# Altium project M8 Minima.PrjPcb (part 3 of 3)

## Sheet 08 usb hub.SchDoc
size A3; SheetNumber: 12; SheetTotal: 16
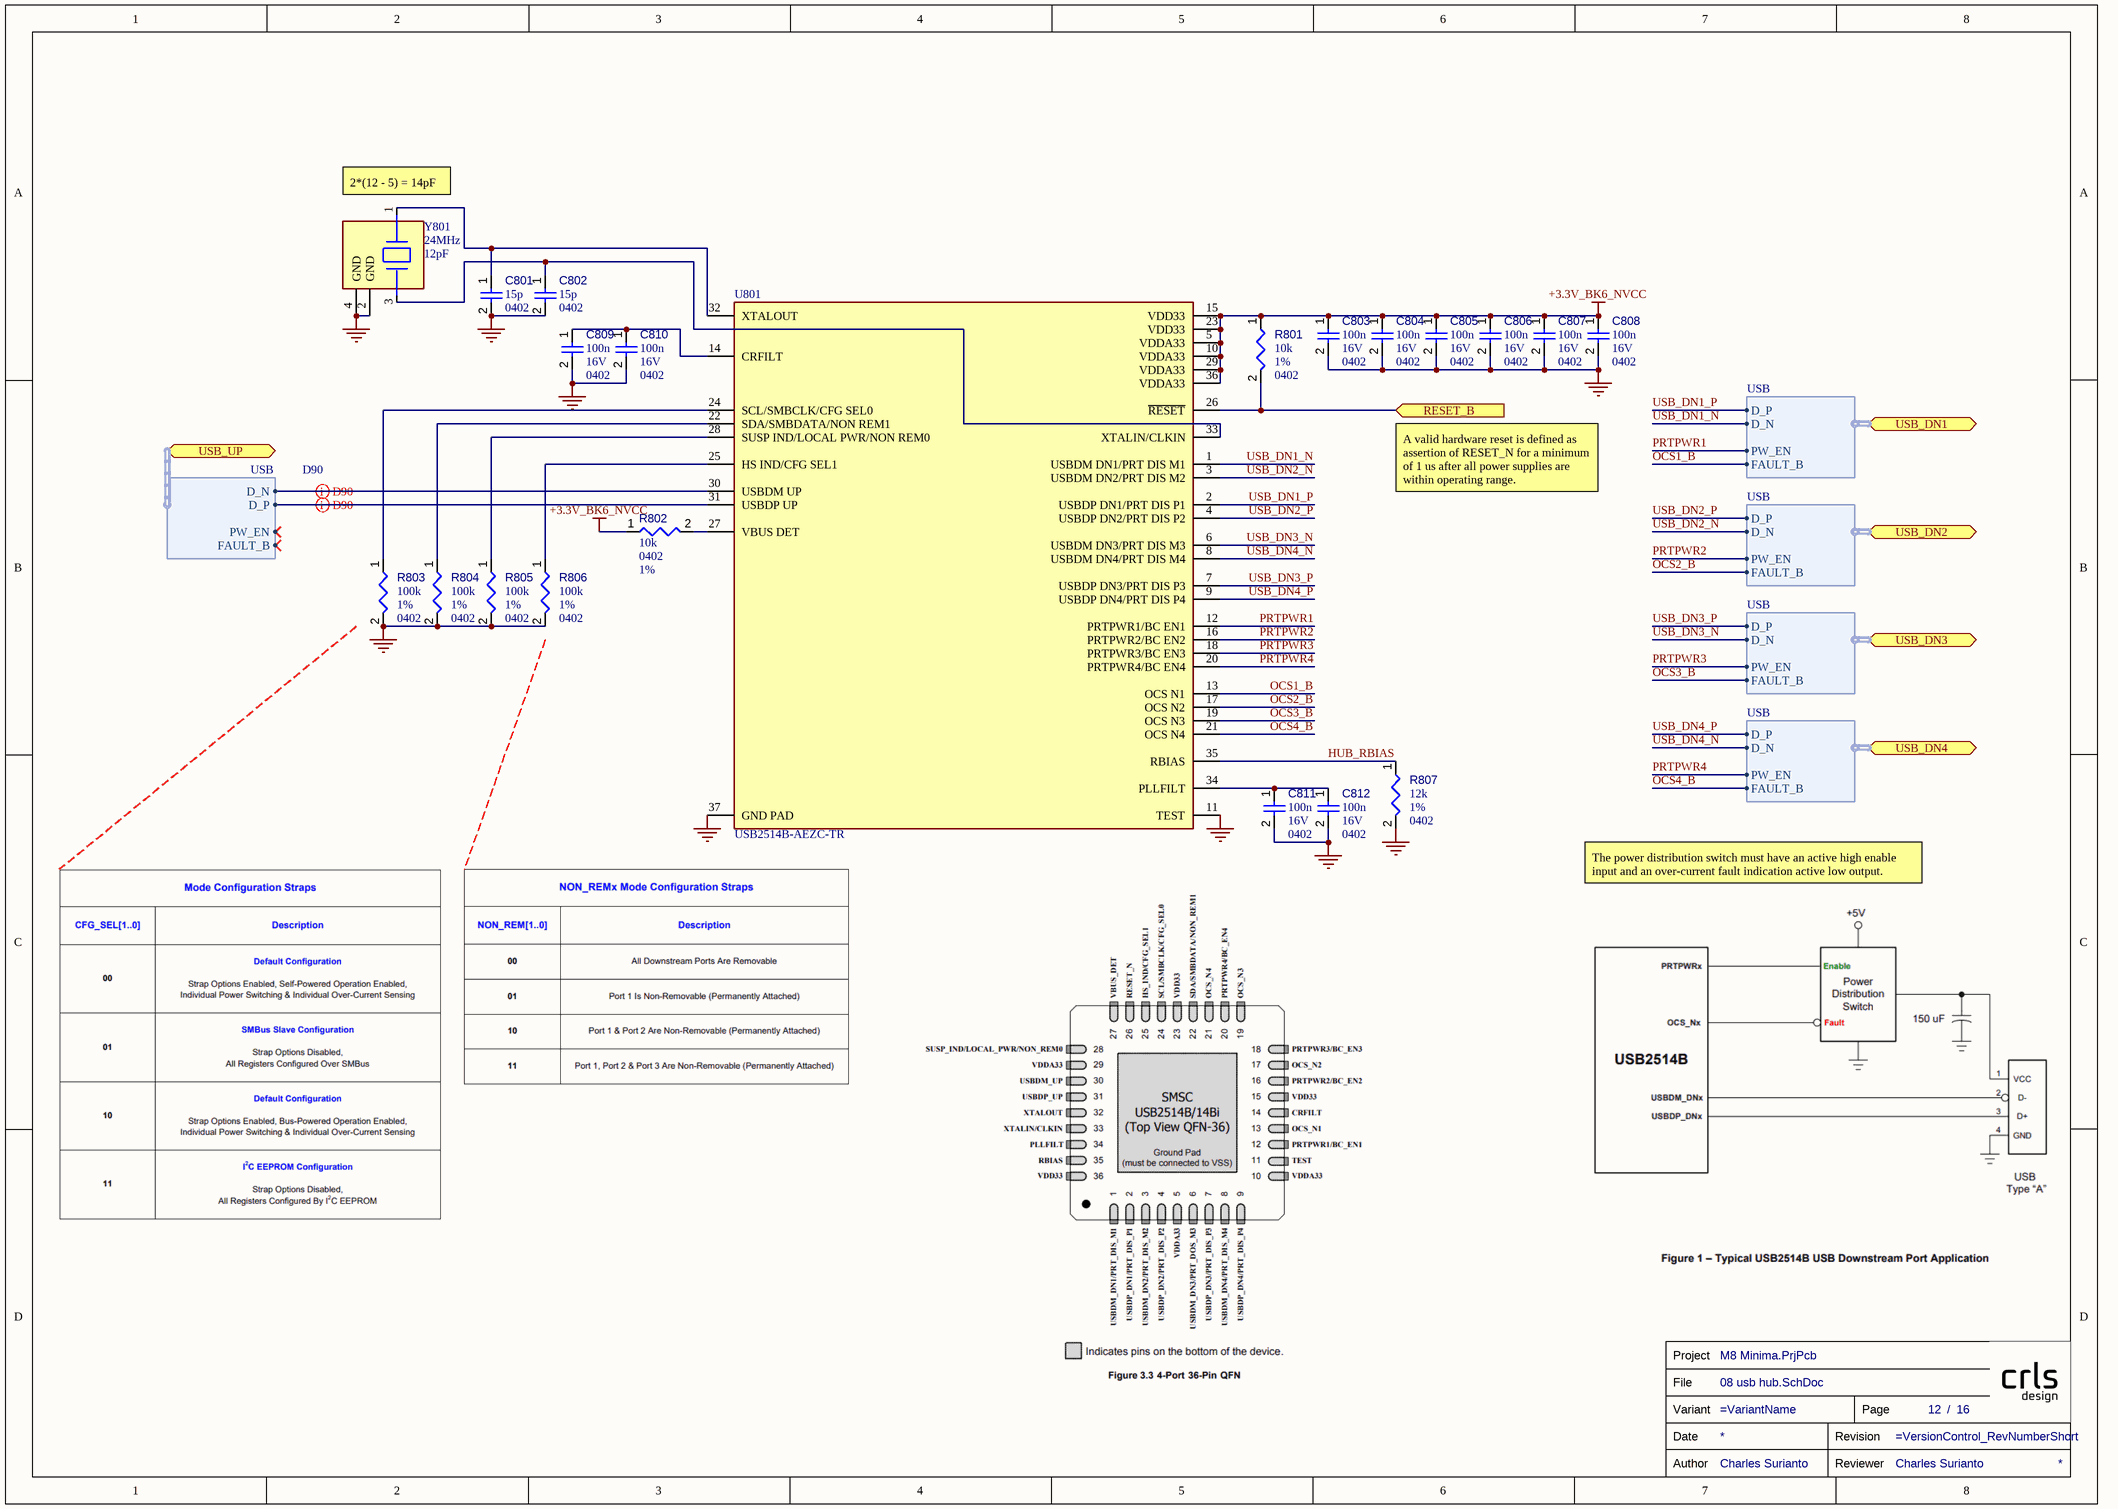
[diagram p9: 08 usb hub.SchDoc]

### Parts
(Parts that share a designator on the sheet are numbered #1, #2 ... from top to bottom, then left to right.)
C801  value 15p  Case/Package: 0402  [CAPC0402(1005)60_L]  (hidden comment: Capacitors,0402,15p)
C802  value 15p  Case/Package: 0402  [CAPC0402(1005)60_L]  (hidden comment: Capacitors,0402,15p)
C803  value 100n  Case/Package: 0402  Voltage Rating: 16V  [CAPC0402(1005)60_L]  (hidden comment: Capacitors,0402,100n,16V)
C804  value 100n  Case/Package: 0402  Voltage Rating: 16V  [CAPC0402(1005)60_L]  (hidden comment: Capacitors,0402,100n,16V)
C805  value 100n  Case/Package: 0402  Voltage Rating: 16V  [CAPC0402(1005)60_L]  (hidden comment: Capacitors,0402,100n,16V)
C806  value 100n  Case/Package: 0402  Voltage Rating: 16V  [CAPC0402(1005)60_L]  (hidden comment: Capacitors,0402,100n,16V)
C807  value 100n  Case/Package: 0402  Voltage Rating: 16V  [CAPC0402(1005)60_L]  (hidden comment: Capacitors,0402,100n,16V)
C808  value 100n  Case/Package: 0402  Voltage Rating: 16V  [CAPC0402(1005)60_L]  (hidden comment: Capacitors,0402,100n,16V)
C809  value 100n  Case/Package: 0402  Voltage Rating: 16V  [CAPC0402(1005)60_L]  (hidden comment: Capacitors,0402,100n,16V)
C810  value 100n  Case/Package: 0402  Voltage Rating: 16V  [CAPC0402(1005)60_L]  (hidden comment: Capacitors,0402,100n,16V)
C811  value 100n  Case/Package: 0402  Voltage Rating: 16V  [CAPC0402(1005)60_L]  (hidden comment: Capacitors,0402,100n,16V)
C812  value 100n  Case/Package: 0402  Voltage Rating: 16V  [CAPC0402(1005)60_L]  (hidden comment: Capacitors,0402,100n,16V)
R801  value 10k  Case/Package: 0402  Tolerance: 1%  [RESC0402(1005)_L]  (hidden comment: Resistors,0402,1%,10k)
R802  value 10k  Case/Package: 0402  Tolerance: 1%  [RESC0402(1005)_L]  (hidden comment: Resistors,0402,1%,10k)
R803  value 100k  Case/Package: 0402  Tolerance: 1%  [RESC0402(1005)_L]  (hidden comment: Resistors,0402,1%,100k)
R804  value 100k  Case/Package: 0402  Tolerance: 1%  [RESC0402(1005)_L]  (hidden comment: Resistors,0402,1%,100k)
R805  value 100k  Case/Package: 0402  Tolerance: 1%  [RESC0402(1005)_L]  (hidden comment: Resistors,0402,1%,100k)
R806  value 100k  Case/Package: 0402  Tolerance: 1%  [RESC0402(1005)_L]  (hidden comment: Resistors,0402,1%,100k)
R807  value 12k  Case/Package: 0402  Tolerance: 1%  [RESC0402(1005)_L]  (hidden comment: Resistors,0402,1%,12k)
TB?#9  Reviewer: Charles Surianto  (hidden comment: TITLE_BLOCK)  (graphical)
U801  USB2514B-AEZC-TR  [FP-USB2514B-AEZC-TR-MFG]
Y801  Load Capacitance: 12pF  Frequency: 24MHz  [FP-TSX-3225-MFG]  (hidden comment: TSX-3225 24.0000MF20G-AC3)

### Ports
RESET_B (in), USB_DN1 (bidir, harness USB), USB_DN2 (bidir, harness USB), USB_DN3 (bidir, harness USB), USB_DN4 (bidir, harness USB), USB_UP (bidir, harness USB)

### Harnesses
USB: D_P, D_N, PW_EN, FAULT_B

### Nets
+3.3V_BK6_NVCC: C803.1 C804.1 C805.1 C806.1 C807.1 C808.1 R801.1 R802.1 U801.5(VDDA33) U801.10(VDDA33) U801.15(VDD33) U801.23(VDD33) U801.29(VDDA33) U801.36(VDDA33)
GND: C801.2 C802.2 C803.2 C804.2 C805.2 C806.2 C807.2 C808.2 C809.2 C810.2 C811.2 C812.2 R803.2 R804.2 R805.2 R806.2 R807.2 U801.11(TEST) U801.37(GND_PAD) Y801.2(GND) Y801.4(GND)
HUB_RBIAS: R807.1 U801.35(RBIAS)
HUB_RST_B: R801.2 U801.26(~{RESET}) ; port RESET_B
OCS1_B: U801.13(OCS_N1) ; port USB_DN1.FAULT_B  [project net HUB_USB1.FAULT_B]
OCS2_B: U801.17(OCS_N2) ; port USB_DN2.FAULT_B  [project net HUB_USB2.FAULT_B]
OCS3_B: U801.19(OCS_N3) ; port USB_DN3.FAULT_B  [project net HUB_USB3.FAULT_B]
OCS4_B: U801.21(OCS_N4) ; port USB_DN4.FAULT_B  [project net HUB_USB4.FAULT_B]
PRTPWR1: U801.12(PRTPWR1/BC_EN1) ; port USB_DN1.PW_EN  [project net HUB_USB1.PW_EN]
PRTPWR2: U801.16(PRTPWR2/BC_EN2) ; port USB_DN2.PW_EN  [project net HUB_USB2.PW_EN]
PRTPWR3: U801.18(PRTPWR3/BC_EN3) ; port USB_DN3.PW_EN  [project net HUB_USB3.PW_EN]
PRTPWR4: U801.20(PRTPWR4/BC_EN4) ; port USB_DN4.PW_EN  [project net HUB_USB4.PW_EN]
USB2.D_N: U801.30(USBDM_UP) ; port USB_UP.D_N
USB2.D_P: U801.31(USBDP_UP) ; port USB_UP.D_P
USB_DN1_N: U801.1(USBDM_DN1/PRT_DIS_M1) ; port USB_DN1.D_N  [project net HUB_USB1.D_N]
USB_DN1_P: U801.2(USBDP_DN1/PRT_DIS_P1) ; port USB_DN1.D_P  [project net HUB_USB1.D_P]
USB_DN2_N: U801.3(USBDM_DN2/PRT_DIS_M2) ; port USB_DN2.D_N  [project net HUB_USB2.D_N]
USB_DN2_P: U801.4(USBDP_DN2/PRT_DIS_P2) ; port USB_DN2.D_P  [project net HUB_USB2.D_P]
USB_DN3_N: U801.6(USBDM_DN3/PRT_DIS_M3) ; port USB_DN3.D_N  [project net HUB_USB3.D_N]
USB_DN3_P: U801.7(USBDP_DN3/PRT_DIS_P3) ; port USB_DN3.D_P  [project net HUB_USB3.D_P]
USB_DN4_N: U801.8(USBDM_DN4/PRT_DIS_M4) ; port USB_DN4.D_N  [project net HUB_USB4.D_N]
USB_DN4_P: U801.9(USBDP_DN4/PRT_DIS_P4) ; port USB_DN4.D_P  [project net HUB_USB4.D_P]
NetC801_1: C801.1 U801.32(XTALOUT) Y801.1
NetC802_1: C802.1 U801.33(XTALIN/CLKIN) Y801.3
NetC809_1: C809.1 C810.1 U801.14(CRFILT)
NetC811_1: C811.1 C812.1 U801.34(PLLFILT)
NetR802_2: R802.2 U801.27(VBUS_DET)
NetR803_1: R803.1 U801.24(SCL/SMBCLK/CFG_SEL0)
NetR804_1: R804.1 U801.22(SDA/SMBDATA/NON_REM1)
NetR805_1: R805.1 U801.28(SUSP_IND/LOCAL_PWR/NON_REM0)
NetR806_1: R806.1 U801.25(HS_IND/CFG_SEL1)

### Layout directives
differential pair; differential pair class D90: USB2.D_N, USB2.D_P

### Notes on the sheet
- (near Y801) 2*(12 - 5) = 14pF
- A valid hardware reset is defined as assertion of RESET_N for a minimum of 1 us after all power supplies are within operating range.
- The power distribution switch must have an active high enable input and an over-current fault indication active low output.
- (in symbol TITLE_BLOCK) Project; File; Variant; Page; /; Date; Revision; Author; Reviewer

### Library data of the parts
C801-C812 = Capacitors: Capacitor; Component Type: Capacitors
R801-R807 = Resistors: Resistor; Component Type: Resistors
U801 = CMP-06284-000026-1: IC CONTROLLER USB 36QFN; Operating Supply Voltage: 3.3V; Operating Supply Current: 70mA; Number of Ports: 4; Lead Free: Lead Free; RoHS Compliant: Yes; Series: -; Case/Package: QFN; Interface: USB; Max Operating Temperature: 85°C; Packaging: Tape and Reel; Min Operating Temperature: 0°C; Package Quantity: 3000; Radiation Hardening: No
Y801 = CMP-36405-000018-1: CRYSTAL 24.0000MHZ 9PF SMD; ESR (Equivalent Series Resistance): 40R; Frequency Stability: 20ppm; Tolerance: 10ppm; Drive Level: 200uW; Min Operating Temperature: -40°C; RoHS Compliant: Yes; Width: 2.5mm; Max Operating Temperature: 105°C; Package Quantity: 250; Mount: Surface Mount; Lead Free: Lead Free; Height: 0.024inch; Depth: 2.5mm; Packaging: Tape and Reel; Series: TSX-3225; Weight: 0.000564oz; Number of Pins: 4; Termination: SMD/SMT; Case/Package: SMD/SMT; Length: 3.2mm; Frequency Tolerance: 10ppm
TB?#9 = TITLE_BLOCK: Review Date: *

## Sheet 11 pcie.SchDoc
size A3; SheetNumber: 15; SheetTotal: 16
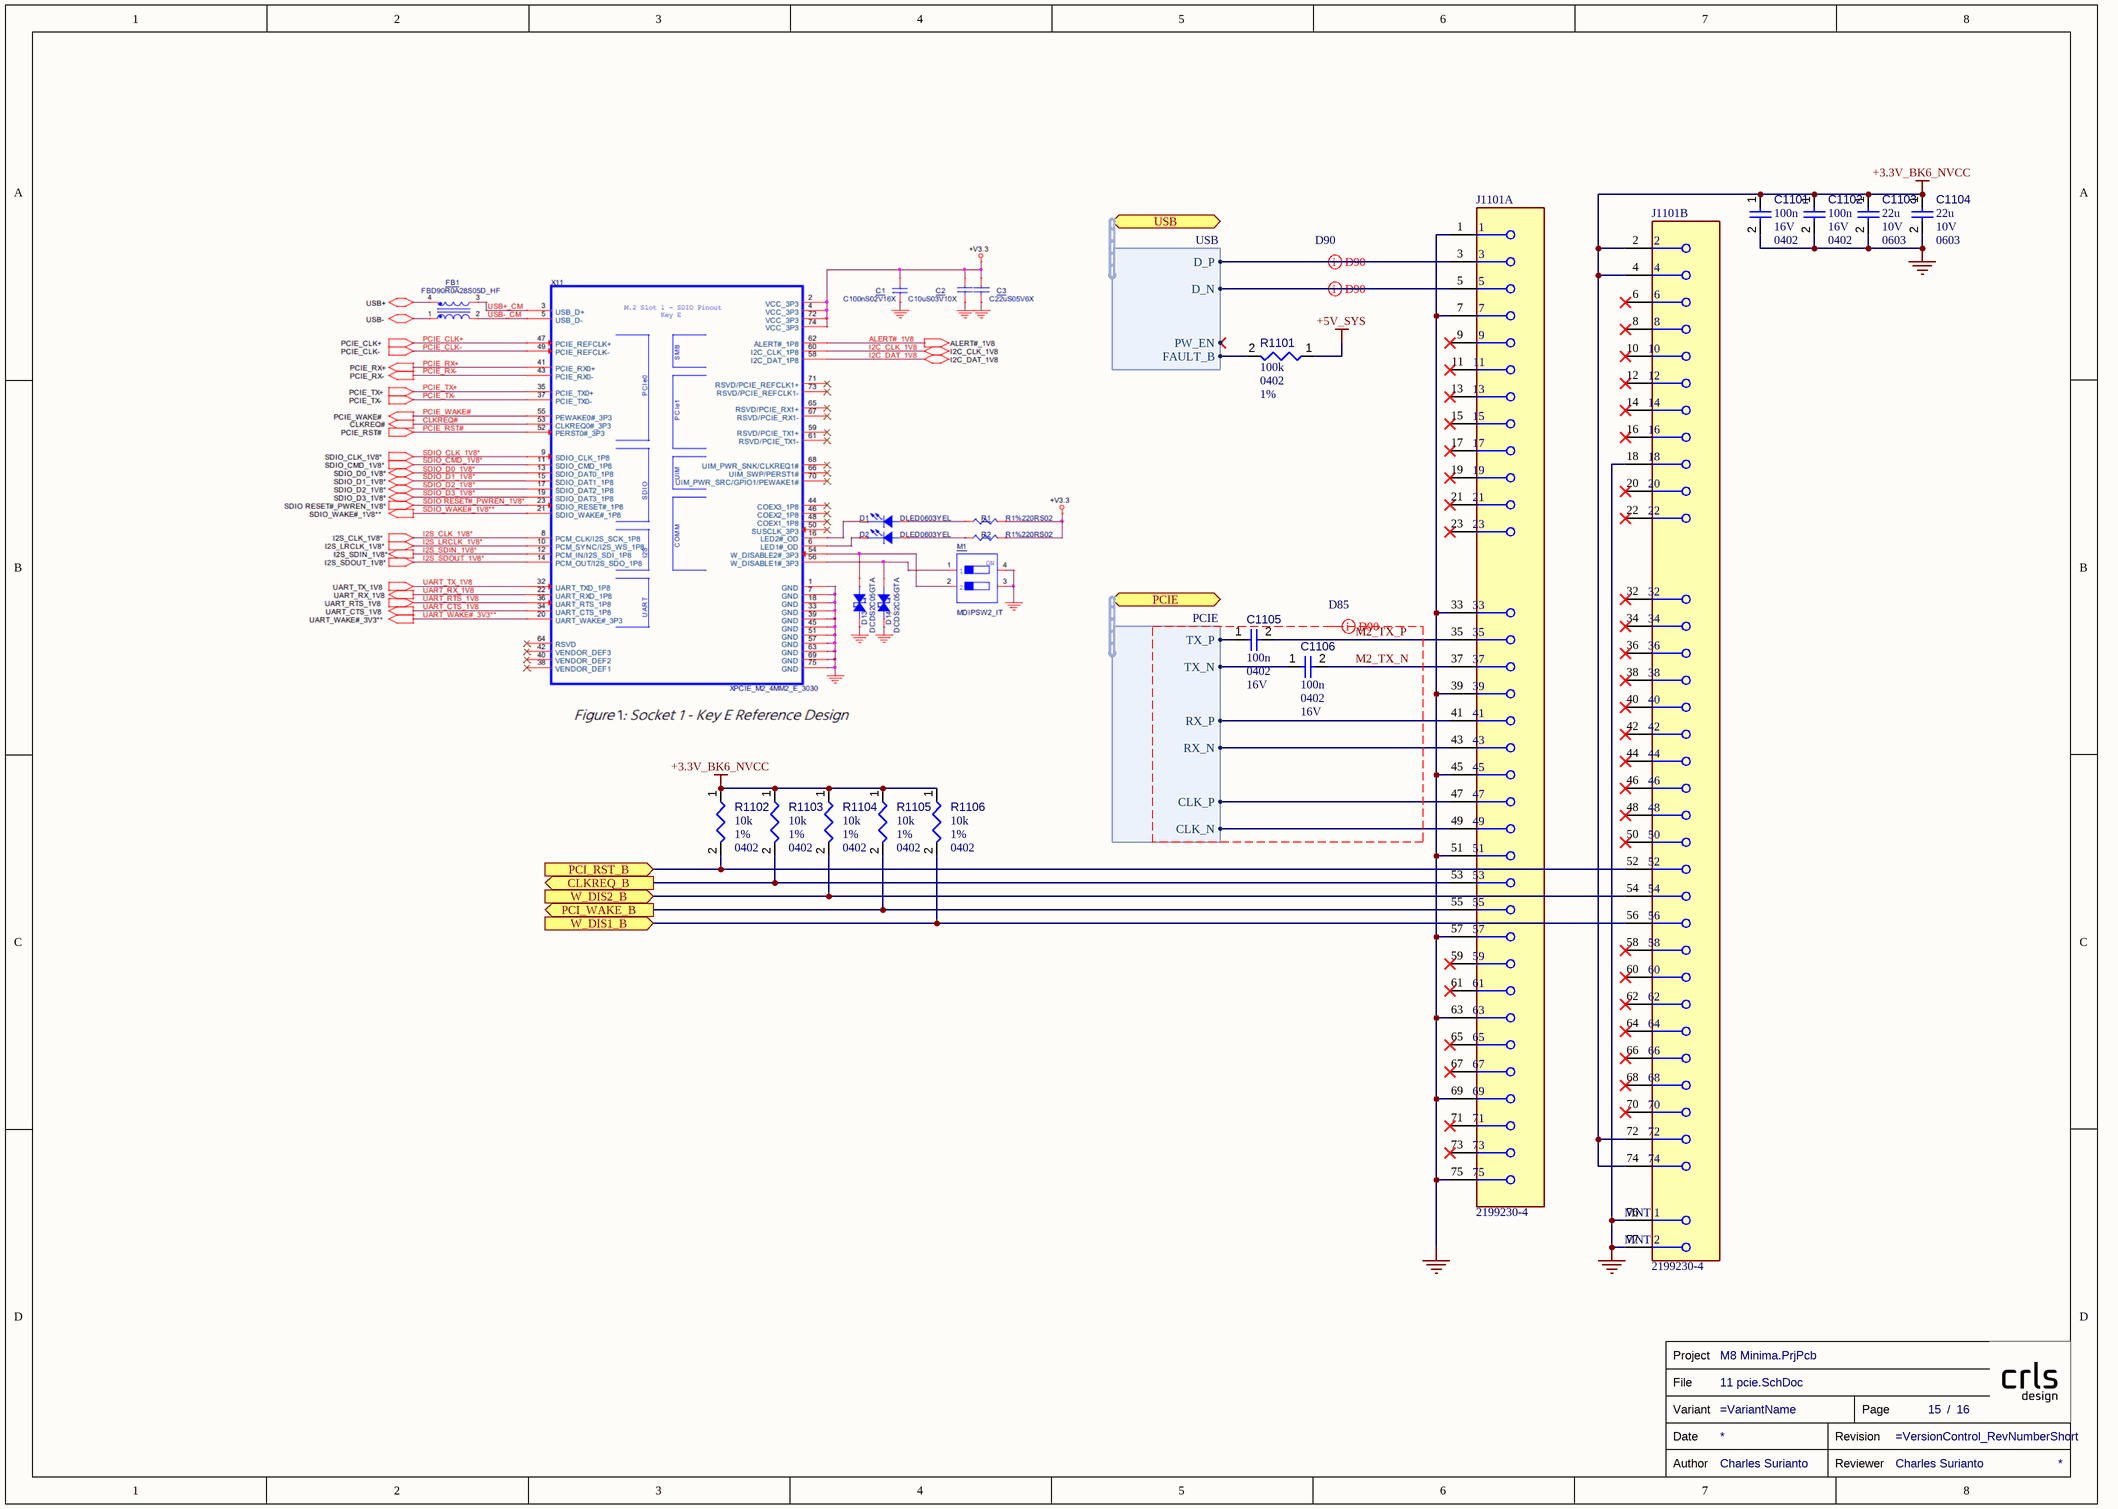
[diagram p10: 11 pcie.SchDoc]

### Parts
(Parts that share a designator on the sheet are numbered #1, #2 ... from top to bottom, then left to right.)
C1101  value 100n  Case/Package: 0402  Voltage Rating: 16V  [CAPC0402(1005)60_L]  (hidden comment: Capacitors,0402,100n,16V)
C1102  value 100n  Case/Package: 0402  Voltage Rating: 16V  [CAPC0402(1005)60_L]  (hidden comment: Capacitors,0402,100n,16V)
C1103  value 22u  Case/Package: 0603  Voltage Rating: 10V  [CAPC0603(1608)100_L]  (hidden comment: Capacitors,0603,22u,10V)
C1104  value 22u  Case/Package: 0603  Voltage Rating: 10V  [CAPC0603(1608)100_L]  (hidden comment: Capacitors,0603,22u,10V)
C1105  value 100n  Case/Package: 0402  Voltage Rating: 16V  [CAPC0402(1005)60_L]  (hidden comment: Capacitors,0402,100n,16V)
C1106  value 100n  Case/Package: 0402  Voltage Rating: 16V  [CAPC0402(1005)60_L]  (hidden comment: Capacitors,0402,100n,16V)
J1101  2199230-4  [FP-2199230-4-MFG]  (parts A,B of 2)
R1101  value 100k  Case/Package: 0402  Tolerance: 1%  [RESC0402(1005)_L]  (hidden comment: Resistors,0402,1%,100k)
R1102  value 10k  Case/Package: 0402  Tolerance: 1%  [RESC0402(1005)_L]  (hidden comment: Resistors,0402,1%,10k)
R1103  value 10k  Case/Package: 0402  Tolerance: 1%  [RESC0402(1005)_L]  (hidden comment: Resistors,0402,1%,10k)
R1104  value 10k  Case/Package: 0402  Tolerance: 1%  [RESC0402(1005)_L]  (hidden comment: Resistors,0402,1%,10k)
R1105  value 10k  Case/Package: 0402  Tolerance: 1%  [RESC0402(1005)_L]  (hidden comment: Resistors,0402,1%,10k)
R1106  value 10k  Case/Package: 0402  Tolerance: 1%  [RESC0402(1005)_L]  (hidden comment: Resistors,0402,1%,10k)
TB?#10  Reviewer: Charles Surianto  (hidden comment: TITLE_BLOCK)  (graphical)

### Ports
CLKREQ_B (out), PCI_RST_B (in), PCI_WAKE_B (out), PCIE (bidir, harness PCIE), USB (bidir, harness USB), W_DIS1_B (in), W_DIS2_B (in)

### Harnesses
PCIE: TX_N, RX_P, RX_N, CLK_N, CLK_P, TX_P
USB: D_P, D_N, FAULT_B, PW_EN

### Nets
+3.3V_BK6_NVCC: C1101.1 C1102.1 C1103.1 C1104.1 J1101.2 J1101.4 J1101.72 J1101.74 R1102.1 R1103.1 R1104.1 R1105.1 R1106.1
+5V_SYS: R1101.1
GND: C1101.2 C1102.2 C1103.2 C1104.2 J1101.1 J1101.7 J1101.18 J1101.33 J1101.39 J1101.45 J1101.51 J1101.57 J1101.63 J1101.69 J1101.75 J1101.76(MNT_1) J1101.77(MNT_2)
CLKREQ_B: J1101.53 R1103.2 ; port CLKREQ_B
HUB_USB4.D_N: J1101.5 ; port USB.D_N
HUB_USB4.D_P: J1101.3 ; port USB.D_P
HUB_USB4.FAULT_B: R1101.2 ; port USB.FAULT_B
M2_TX_N: C1106.2 J1101.37
M2_TX_P: C1105.2 J1101.35
PCI_RST_B: J1101.52 R1102.2 ; port PCI_RST_B
PCI_WAKE_B: J1101.55 R1105.2 ; port PCI_WAKE_B
PCIE.CLK_N: J1101.49 ; port PCIE.CLK_N
PCIE.CLK_P: J1101.47 ; port PCIE.CLK_P
PCIE.RX_N: J1101.43 ; port PCIE.RX_N
PCIE.RX_P: J1101.41 ; port PCIE.RX_P
PCIE.TX_N: C1106.1 ; port PCIE.TX_N
PCIE.TX_P: C1105.1 ; port PCIE.TX_P
W_DIS1_B: J1101.56 R1106.2 ; port W_DIS1_B
W_DIS2_B: J1101.54 R1104.2 ; port W_DIS2_B

Not connected (* = marked no-connect by the designer): J1101 6* 8* 9* 10* 11* 12* 13* 14* 15* 16* 17* 19* 20* 21* 22* 23* 32* 34* 36* 38* 40* 42* 44* 46* 48* 50* 58* 59* 60* 61* 62* 64* 65* 66* 67* 68* 70* 71* 73*

### Layout directives
differential pair; differential pair class D85: M2_TX_N, M2_TX_P
differential pair; differential pair class D90: HUB_USB4.D_N, HUB_USB4.D_P

### Notes on the sheet
- (in symbol TITLE_BLOCK) Project; File; Variant; Page; /; Date; Revision; Author; Reviewer

### Library data of the parts
C1101-C1106 = Capacitors: Capacitor; Component Type: Capacitors
J1101 = CMP-03365-000002-1: CONN FEMALE 67POS 0.020 GOLD; Manufacturer: TE Connectivity; Conn Orientation: Right Angle; Pitch: 0.5mm; Number Of Contacts: 67; Voltage Rating: 50V; Is Female: yes; Current Rating: 0.5A; Lead Free: Yes; Temperature Range Low: -40°C; Device Class L3: unset; Package: 0; Manufacturer Part Number: 2199230-4; RoHS: TRUE; Digikey Description: CONN FEMALE 67POS 0.020 GOLD; Category: Conn; Device Class L1: Connectors; Temperature Range High: +80°C; ComponentLink2Description: Datasheet; ComponentLink2URL: https://www.te.com/commerce/DocumentDelivery/DDEController?Action=showdoc&DocId=Customer+Drawing%7F2199230%7FB3%7Fpdf%7FEnglish%7FENG_CD_2199230_B3.pdf%7F2199230-4; Mouser Description: PCI Express / PCI Connectors .5PITCH 4.2H KEY E EMBOSS NGFF MINICARD; Automotive: No; Conn Gender: Female; Height: 4.2mm; Device Class L2: Card Edge Connectors; Contact Material: Gold,Nickel; Number Of Rows: 2; Octopart: https://octopart.com/2199230-4-te+connectivity-46436156; Temperature: -40°C to +80°C
R1101-R1106 = Resistors: Resistor; Component Type: Resistors
TB?#10 = TITLE_BLOCK: Review Date: *

## Sheet 09 usb device port.SchDoc
size A3; SheetNumber: 13; SheetTotal: 16
Used 2 times, as channels USB_UART, USB1. Parts and nets are listed once, with the designators drawn on the sheet.
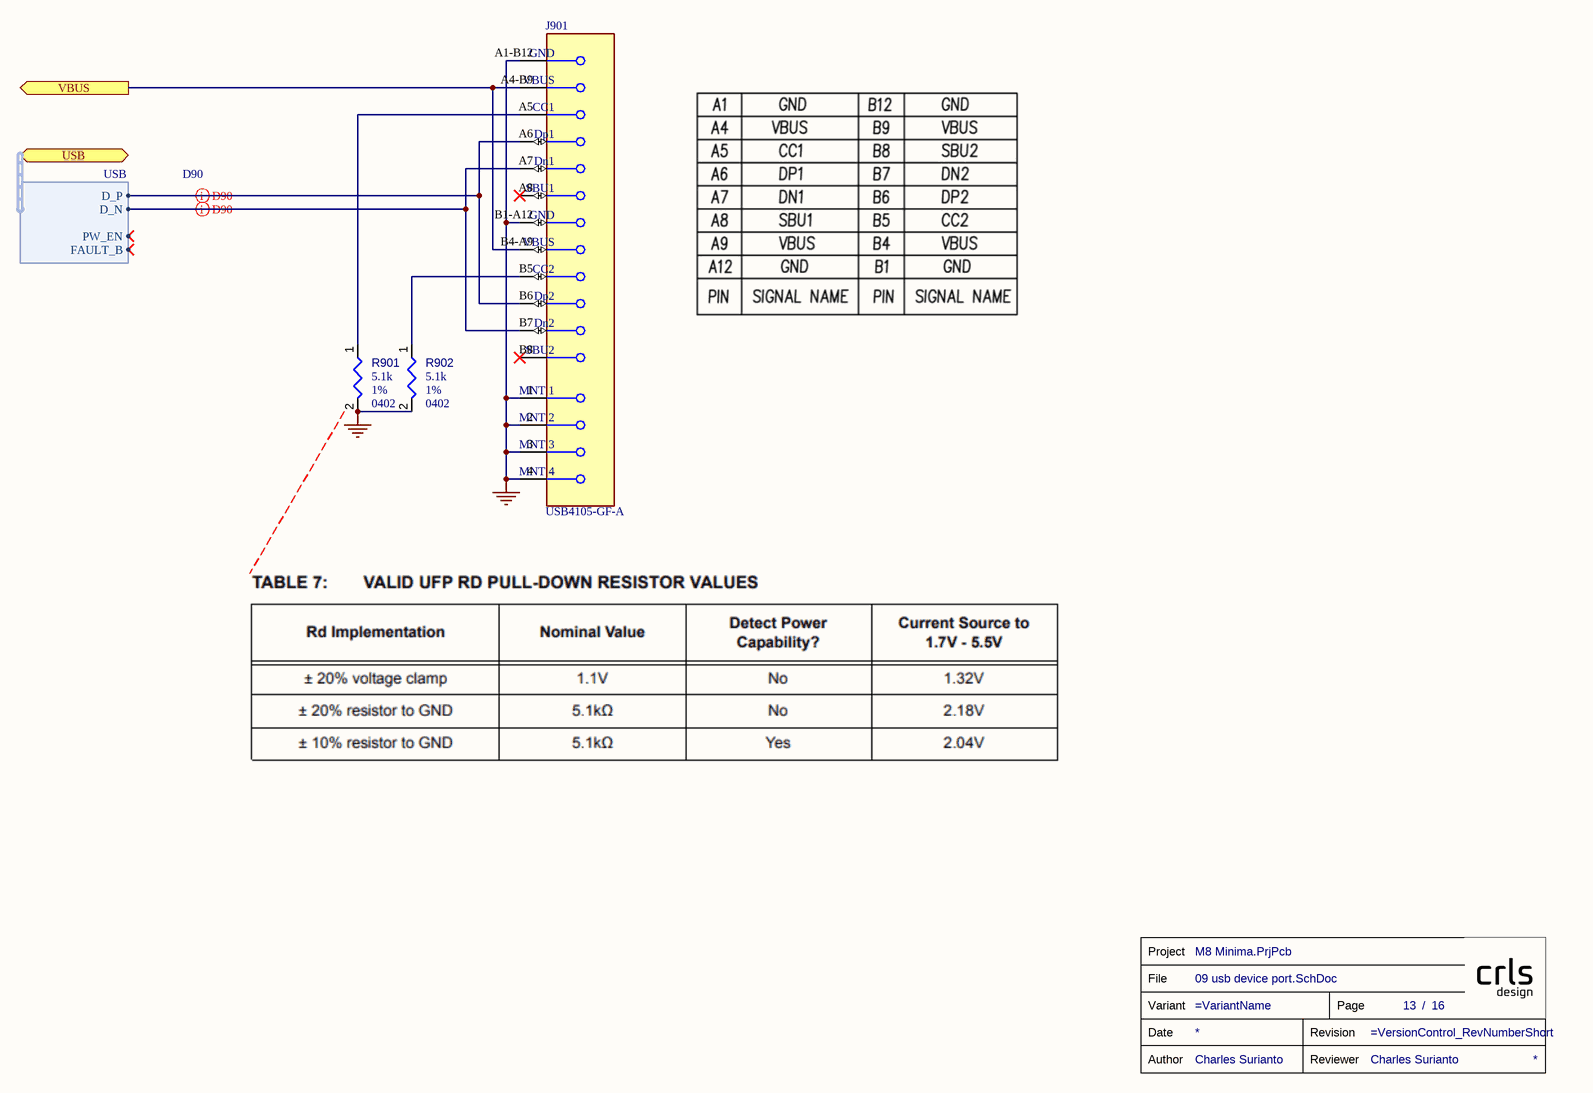
[diagram p11: 09 usb device port.SchDoc]

### Parts
J901  USB4105-GF-A  [FP-USB4105-GF-A-MFG]
R901  value 5.1k  Case/Package: 0402  Tolerance: 1%  [RESC0402(1005)_L]  (hidden comment: Resistors,0402,1%,5.1k)
R902  value 5.1k  Case/Package: 0402  Tolerance: 1%  [RESC0402(1005)_L]  (hidden comment: Resistors,0402,1%,5.1k)
TB?  Reviewer: Charles Surianto  (hidden comment: TITLE_BLOCK)  (graphical)

### Ports
USB (bidir, harness USB), VBUS (out)

### Harnesses
USB: D_P, D_N, PW_EN, FAULT_B

### Nets
GND: J901.1(MNT_1) J901.2(MNT_2) J901.3(MNT_3) J901.4(MNT_4) J901.A1-B12(GND) J901.B1-A12(GND) R901.2 R902.2
VBUS: J901.A4-B9(VBUS) J901.B4-A9(VBUS) ; port VBUS
NetJ901_A5: J901.A5(CC1) R901.1
NetJ901_A6: J901.A6(Dp1) J901.B6(Dp2) ; port USB.D_P
NetJ901_A7: J901.A7(Dn1) J901.B7(Dn2) ; port USB.D_N
NetJ901_B5: J901.B5(CC2) R902.1

Not connected (* = marked no-connect by the designer): J901 A8(SBU1)* B8(SBU2)*

### Channels
USB_UART: designators end in _USB_UART; ports VBUS=UART_VBUS
USB1: designators end in _USB1; ports VBUS=VBUS1

### Layout directives
differential pair; differential pair class D90: UART_USB.D_N, UART_USB.D_P

### Notes on the sheet
- (in symbol TITLE_BLOCK) Project; File; Variant; Page; /; Date; Revision; Author; Reviewer

### Library data of the parts
J901 = CMP-245163-000001-1: CONN RCPT USB2.0 TYPEC 5A; Manufacturer: GCT; Voltage Rating: 20V; Is Female: yes; Current Rating: 5/6.25/1.25/0.25A; Number Of Contacts: 16; Conn Orientation: Right Angle; Device Class L1: Connectors; Category: Conn; Lead Free: Yes; RoHS: TRUE; Temperature Range High: +85°C; Digikey Description: CONN RCPT USB2.0 TYPEC 5A; Device Class L3: unset; ComponentLink2Description: Datasheet; Manufacturer Part Number: USB4105-GF-A; Package: 0; Usb Standard: USB 2.0; Device Class L2: USB Connectors; Automotive: No; Temperature Range Low: -40°C; Height: 3.46mm; Temperature: -40°C to +85°C; Contact Material: Gold,Nickel; ComponentLink2URL: https://gct.co/files/drawings/usb4105.pdf; Octopart: https://octopart.com/usb4105-gf-a-gct-106627878
R901 R902 = Resistors: Resistor; Component Type: Resistors
TB? = TITLE_BLOCK: Review Date: *

## Sheet 10 usb host port.SchDoc
size A3; SheetNumber: 14; SheetTotal: 16
Used 3 times, as channels USBH1, USBH2, USBH3. Parts and nets are listed once, with the designators drawn on the sheet.
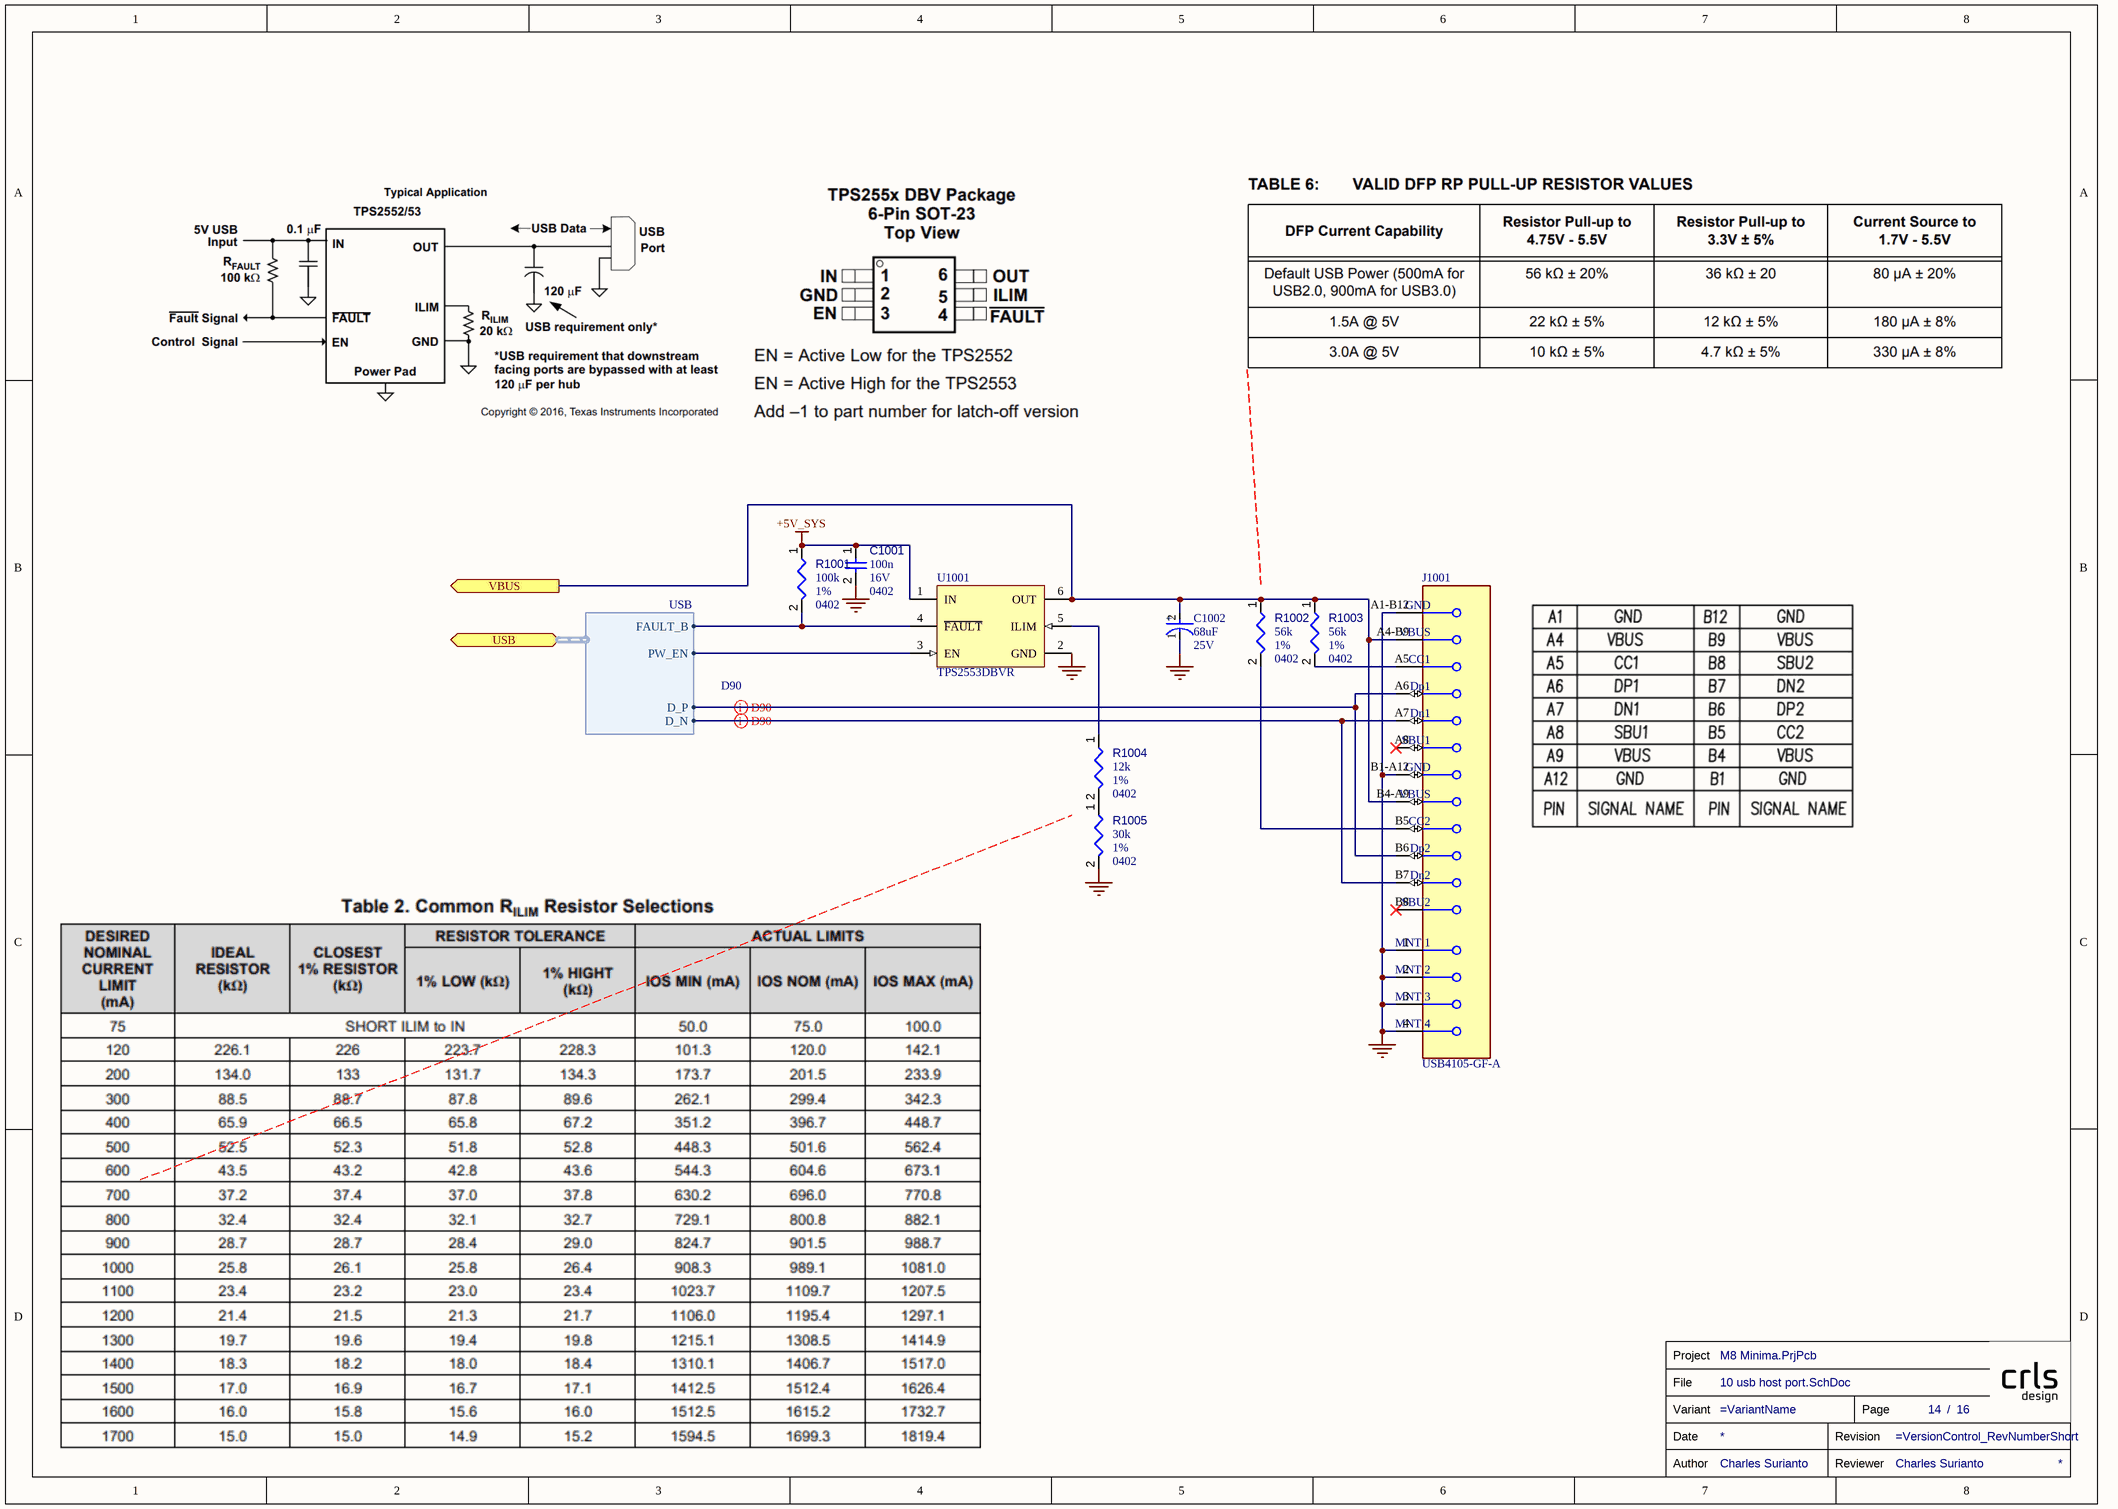
[diagram p12: 10 usb host port.SchDoc]

### Parts
C1001  value 100n  Case/Package: 0402  Voltage Rating: 16V  [CAPC0402(1005)60_L]  (hidden comment: Capacitors,0402,100n,16V)
C1002  Voltage Rating: 25V  Capacitance: 68uF  [FP-POSCAP-D3L-MFG]  (hidden comment: 25TQC68MYF)
J1001  USB4105-GF-A  [FP-USB4105-GF-A-MFG]
R1001  value 100k  Case/Package: 0402  Tolerance: 1%  [RESC0402(1005)_L]  (hidden comment: Resistors,0402,1%,100k)
R1002  value 56k  Case/Package: 0402  Tolerance: 1%  [RESC0402(1005)_L]  (hidden comment: Resistors,0402,1%,56k)
R1003  value 56k  Case/Package: 0402  Tolerance: 1%  [RESC0402(1005)_L]  (hidden comment: Resistors,0402,1%,56k)
R1004  value 12k  Case/Package: 0402  Tolerance: 1%  [RESC0402(1005)_L]  (hidden comment: Resistors,0402,1%,12k)
R1005  value 30k  Case/Package: 0402  Tolerance: 1%  [RESC0402(1005)_L]  (hidden comment: Resistors,0402,1%,30k)
TB?  Reviewer: Charles Surianto  (hidden comment: TITLE_BLOCK)  (graphical)
U1001  TPS2553DBVR  [DBV0006A_M]

### Ports
USB (bidir, harness USB), VBUS (out)

### Harnesses
USB: FAULT_B, PW_EN, D_P, D_N

### Nets
+5V_SYS: C1001.1 R1001.1 U1001.1(IN)
GND: C1001.2 C1002.1(C) J1001.1(MNT_1) J1001.2(MNT_2) J1001.3(MNT_3) J1001.4(MNT_4) J1001.A1-B12(GND) J1001.B1-A12(GND) R1005.2 U1001.2(GND)
VBUS: C1002.2(A) J1001.A4-B9(VBUS) J1001.B4-A9(VBUS) R1002.1 R1003.1 U1001.6(OUT) ; port VBUS
NetJ1001_A5: J1001.A5(CC1) R1003.2
NetJ1001_A6: J1001.A6(Dp1) J1001.B6(Dp2) ; port USB.D_P
NetJ1001_A7: J1001.A7(Dn1) J1001.B7(Dn2) ; port USB.D_N
NetJ1001_B5: J1001.B5(CC2) R1002.2
NetR1001_2: R1001.2 U1001.4(~{FAULT}) ; port USB.FAULT_B
NetR1004_1: R1004.1 U1001.5(ILIM)
NetR1004_2: R1004.2 R1005.1
NetU1001_3: U1001.3(EN) ; port USB.PW_EN

Not connected (* = marked no-connect by the designer): J1001 A8(SBU1)* B8(SBU2)*

### Channels
USBH1: designators end in _USBH1; ports VBUS=VBUS_USBH1
USBH2: designators end in _USBH2; ports VBUS=VBUS_USBH2
USBH3: designators end in _USBH3; ports VBUS=VBUS_USBH3

### Layout directives
differential pair; differential pair class D90: HUB_USB1.D_N, HUB_USB1.D_P

### Notes on the sheet
- (in symbol CMP-05428-000983-1) +
- (in symbol TITLE_BLOCK) Project; File; Variant; Page; /; Date; Revision; Author; Reviewer

### Library data of the parts
C1001 = Capacitors: Capacitor; Component Type: Capacitors
C1002 = CMP-05428-000983-1: Molded Tantalum Polymer Capacitor 68uF 20% 25V life 2000Hours SMD 2917; ESR (Equivalent Series Resistance): 70mR; Lead Free: Lead Free; Packaging: Tape and Reel; Max Operating Temperature: 105°C; Features: General Purpose; REACH SVHC: No SVHC; RoHS Compliant: Yes; Voltage Rating (DC): 25V; Mount: Surface Mount; Min Operating Temperature: -55°C; Case Code (Imperial): 2917; Case Code (Metric): 7343; Tolerance: 20%; Series: POSCAP™ TQC; Case/Package: 2917; Package Quantity: 2500
J1001 = CMP-245163-000001-1: as J901 on sheet 09 usb device port; Device Class L1: Connectors; Category: Conn; Lead Free: Yes; RoHS: TRUE; Temperature Range High: +85°C; Digikey Description: CONN RCPT USB2.0 TYPEC 5A; Device Class L3: unset; ComponentLink2Description: Datasheet; Manufacturer Part Number: USB4105-GF-A; Package: 0; Usb Standard: USB 2.0; Device Class L2: USB Connectors; Automotive: No; Temperature Range Low: -40°C; Height: 3.46mm; Temperature: -40°C to +85°C; Contact Material: Gold,Nickel; ComponentLink2URL: https://gct.co/files/drawings/usb4105.pdf; Octopart: https://octopart.com/usb4105-gf-a-gct-106627878
R1001-R1005 = Resistors: Resistor; Component Type: Resistors
U1001 = CMP-0337-00284-2: Adjustable, Active High, Constant-Current, Current-Limited Power-Distribution Switch, 0.075 to 1.7 A Current Limit, -40 to 85 degC, 6-pin SOT-23 (DBV), Green (RoHS & no Sb/Br); Manufacturer: Texas Instruments; Continuous Current(Max)(A): 1.5; Vin(Min)(V): 2.5; Current Limit Accuracy @ 1A: +/-7.5% (925mA min / 1075mA max); Vin(Max)(V): 6.5; Rating: Catalog; rDS(on) per FET(Typ)(mOhms): 100/DRV, 85/DBV; Number of Switches: 1; ComponentLink1Description: Datasheet; PartNumber: TPS2553DBVR; Enable: Active High; PackageDescription: 6-Pin Plastic Small-Outline Package, 2.9 x 1.6 mm Body, 0.95 mm Pitch, 2.8 mm Lead Span; DatasheetVersion: SLVS841E; Code_JEDEC: MO-178-AB*; Current Limit Topology: Constant-Current; Mounting Technology: Surface Mount; Eco-Plan: Green (RoHS & no Sb/Br); PackageVersion: revK, Mar-2006; PackageReference: DBV0006A; ComponentLink1URL: http://www.ti.com/general/docs/lit/getliterature.tsp?genericPartNumber=TPS2553&fileType=pdf; Current Limit(A): 0.075 to 1.7
TB? = TITLE_BLOCK: Review Date: *

## Sheet 04-3 m8 io 2.SchDoc
size A3; SheetNumber: 7; SheetTotal: 16
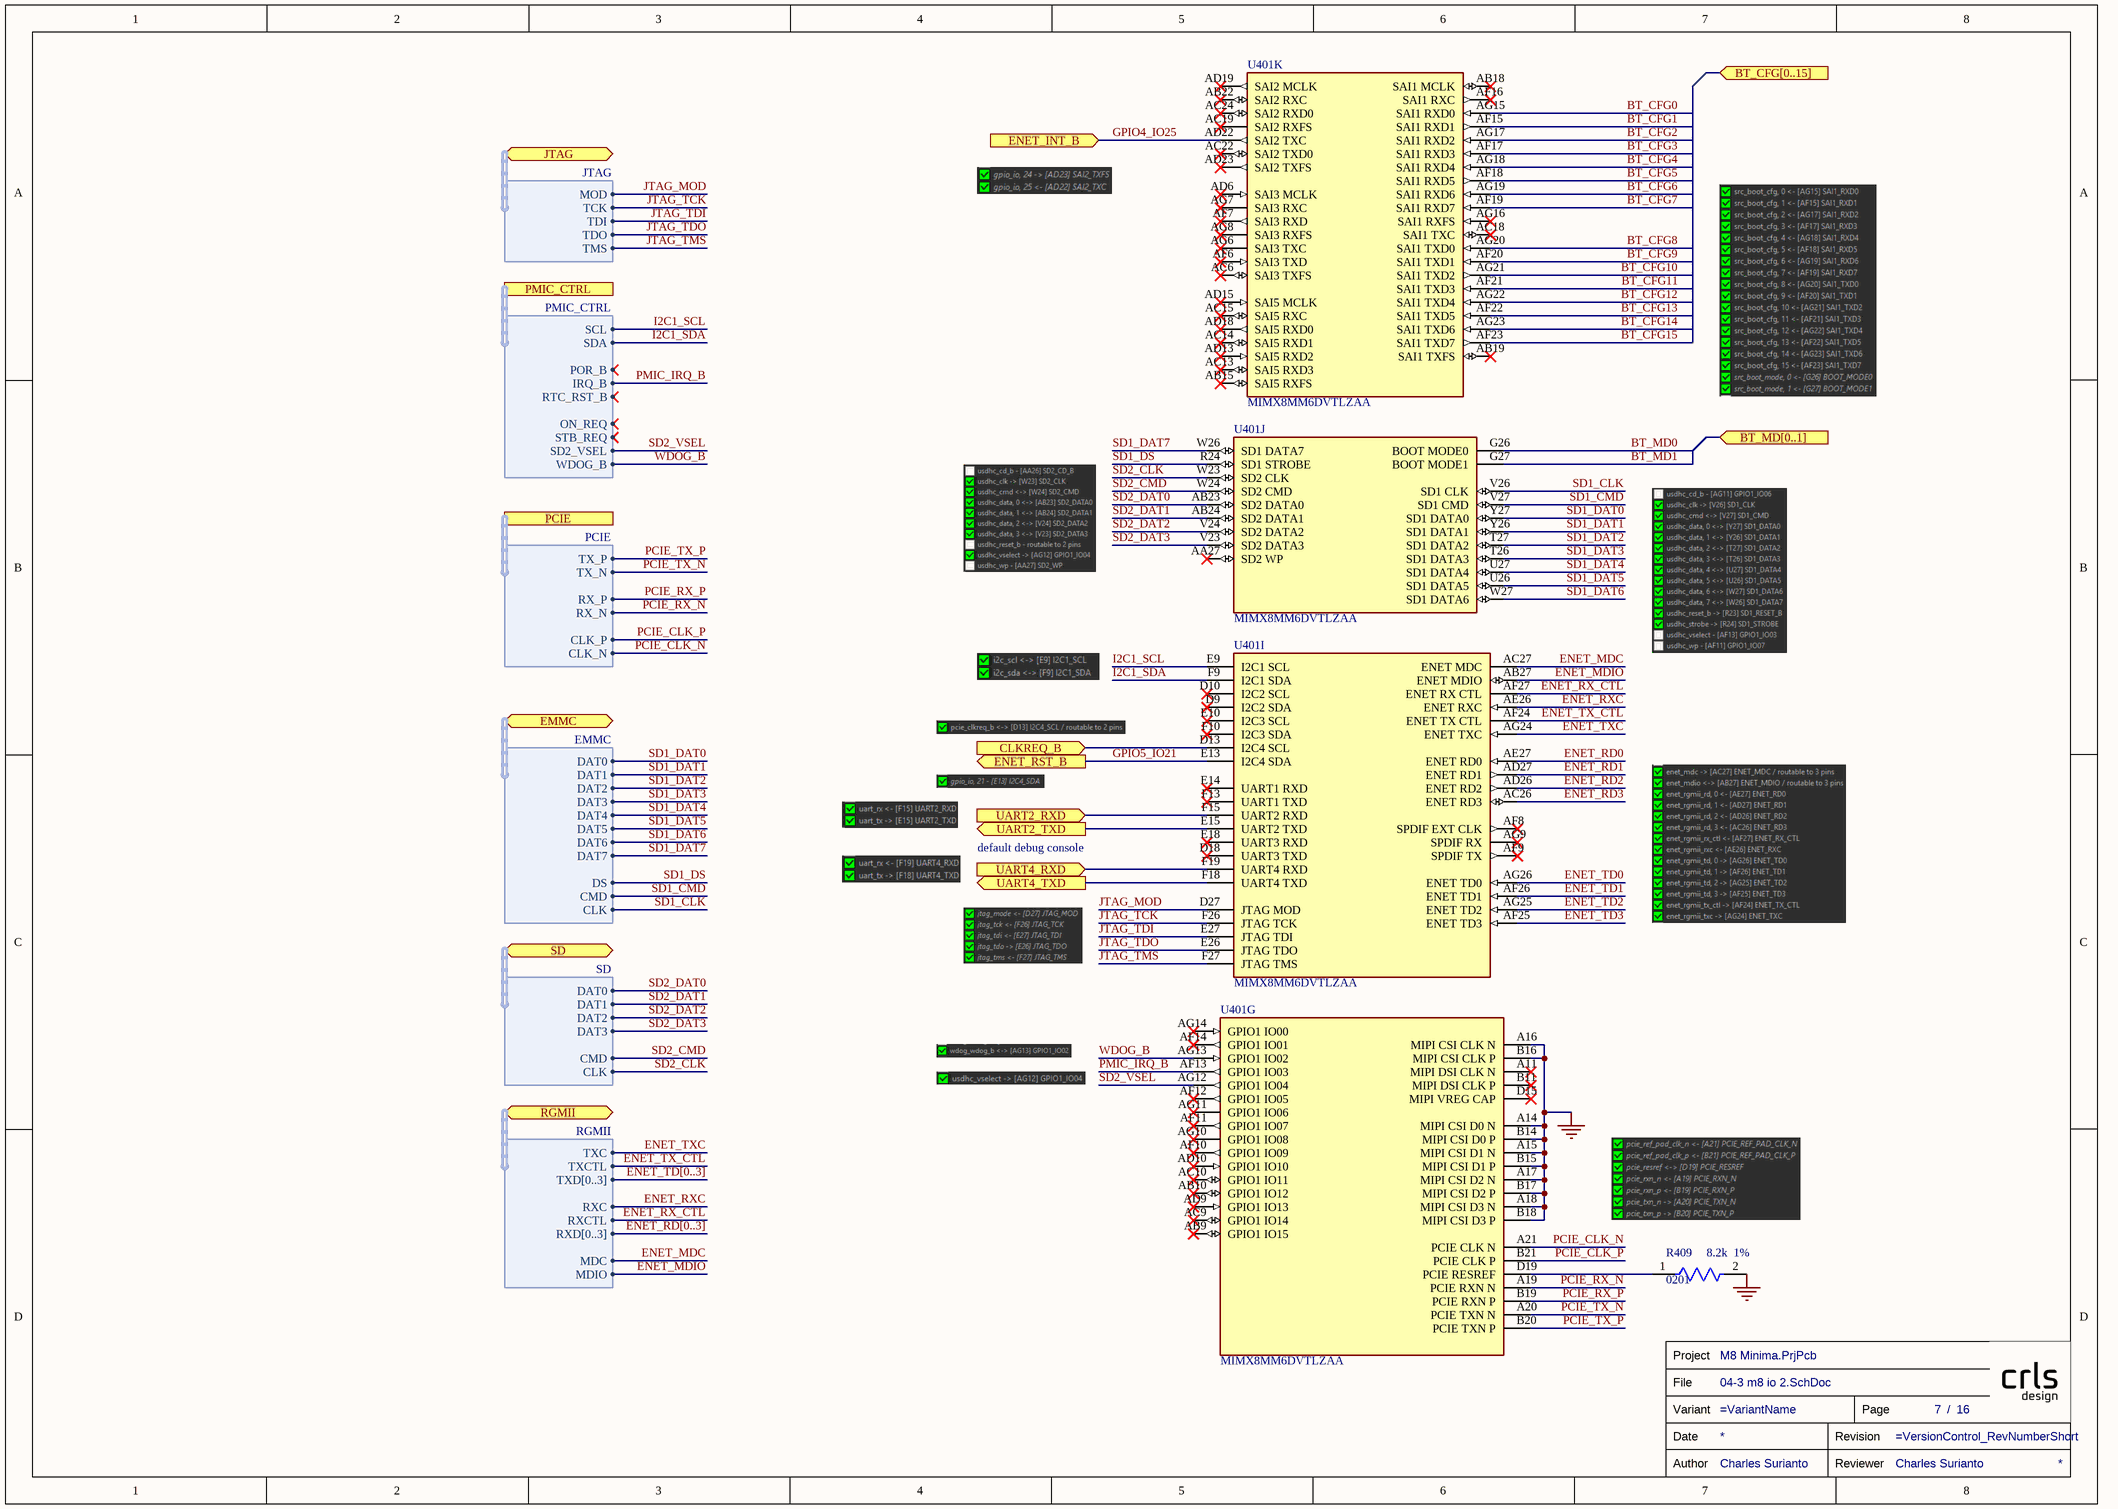
[diagram p13: 04-3 m8 io 2.SchDoc]

### Parts
(Parts that share a designator on the sheet are numbered #1, #2 ... from top to bottom, then left to right.)
R409  Resistance: 8.2k  Tolerance: 1%  Case/Package: 0201  [FP-AF0201-MFG]  (hidden comment: AF0201FR-078K2L)
TB?#11  Reviewer: Charles Surianto  (hidden comment: TITLE_BLOCK)  (graphical)
U401  MIMX8MM6DVTLZAA  [FP-SOT1967-2-IPC_A]  (parts G,I,J,K of 11)

### Ports
BT_CFG[0..15] (in), BT_MD[0..1] (in), CLKREQ_B (in), EMMC (bidir, harness EMMC), ENET_INT_B (in), ENET_RST_B (out), JTAG (bidir, harness JTAG), PCIE (harness PCIE), PMIC_CTRL (harness PMIC_CTRL), RGMII (bidir, harness RGMII), SD (bidir, harness SD), UART2_RXD (in), UART2_TXD (out), UART4_RXD (in), UART4_TXD (out)

### Harnesses
PCIE: TX_P, TX_N, RX_P, RX_N, CLK_P, CLK_N
PMIC_CTRL: SCL, SDA, IRQ_B, POR_B, RTC_RST_B, ON_REQ, STB_REQ, SD2_VSEL, WDOG_B
SD: DAT3, DAT0, DAT1, DAT2, CMD, CLK
EMMC: DAT1, DAT3, DAT2, DAT4, DAT0, DAT5, DAT6, DAT7, DS, CMD, CLK
RGMII: TXC, TXCTL, TXD[0..3], RXC, RXCTL, RXD[0..3], MDIO, MDC
JTAG: MOD, TCK, TDI, TDO, TMS

### Nets
GND: R409.2 U401.A14(MIPI_CSI_D0_N) U401.A15(MIPI_CSI_D1_N) U401.A16(MIPI_CSI_CLK_N) U401.A17(MIPI_CSI_D2_N) U401.A18(MIPI_CSI_D3_N) U401.B14(MIPI_CSI_D0_P) U401.B15(MIPI_CSI_D1_P) U401.B16(MIPI_CSI_CLK_P) U401.B17(MIPI_CSI_D2_P) U401.B18(MIPI_CSI_D3_P)
BT_CFG0: U401.AG15(SAI1_RXD0)
BT_CFG1: U401.AF15(SAI1_RXD1)
BT_CFG2: U401.AG17(SAI1_RXD2)
BT_CFG3: U401.AF17(SAI1_RXD3)
BT_CFG4: U401.AG18(SAI1_RXD4)
BT_CFG5: U401.AF18(SAI1_RXD5)
BT_CFG6: U401.AG19(SAI1_RXD6)
BT_CFG7: U401.AF19(SAI1_RXD7)
BT_CFG8: U401.AG20(SAI1_TXD0)
BT_CFG9: U401.AF20(SAI1_TXD1)
BT_CFG10: U401.AG21(SAI1_TXD2)
BT_CFG11: U401.AF21(SAI1_TXD3)
BT_CFG12: U401.AG22(SAI1_TXD4)
BT_CFG13: U401.AF22(SAI1_TXD5)
BT_CFG14: U401.AG23(SAI1_TXD6)
BT_CFG15: U401.AF23(SAI1_TXD7)
BT_MD0: U401.G26(BOOT_MODE0)
BT_MD1: U401.G27(BOOT_MODE1)
CLKREQ_B: U401.D13(I2C4_SCL) ; port CLKREQ_B
ENET_MDC: U401.AC27(ENET_MDC) ; port RGMII.MDC  [project net RGMII.MDC]
ENET_MDIO: U401.AB27(ENET_MDIO) ; port RGMII.MDIO  [project net RGMII.MDIO]
ENET_RD0: U401.AE27(ENET_RD0)
ENET_RD1: U401.AD27(ENET_RD1)
ENET_RD2: U401.AD26(ENET_RD2)
ENET_RD3: U401.AC26(ENET_RD3)
ENET_RX_CTL: U401.AF27(ENET_RX_CTL) ; port RGMII.RXCTL  [project net RGMII.RXCTL]
ENET_RXC: U401.AE26(ENET_RXC) ; port RGMII.RXC  [project net RGMII.RXC]
ENET_TD0: U401.AG26(ENET_TD0)
ENET_TD1: U401.AF26(ENET_TD1)
ENET_TD2: U401.AG25(ENET_TD2)
ENET_TD3: U401.AF25(ENET_TD3)
ENET_TX_CTL: U401.AF24(ENET_TX_CTL) ; port RGMII.TXCTL  [project net RGMII.TXCTL]
ENET_TXC: U401.AG24(ENET_TXC) ; port RGMII.TXC  [project net RGMII.TXC]
GPIO4_IO25: U401.AD22(SAI2_TXC) ; port ENET_INT_B  [project net ENET_INT_B]
GPIO5_IO21: U401.E13(I2C4_SDA) ; port ENET_RST_B  [project net ENET_RST_B]
I2C1_SCL: U401.E9(I2C1_SCL) ; port PMIC_CTRL.SCL  [project net PMIC_CTRL.SCL]
I2C1_SDA: U401.F9(I2C1_SDA) ; port PMIC_CTRL.SDA  [project net PMIC_CTRL.SDA]
JTAG_MOD: U401.D27(JTAG_MOD) ; port JTAG.MOD
JTAG_TCK: U401.F26(JTAG_TCK) ; port JTAG.TCK
JTAG_TDI: U401.E27(JTAG_TDI) ; port JTAG.TDI
JTAG_TDO: U401.E26(JTAG_TDO) ; port JTAG.TDO
JTAG_TMS: U401.F27(JTAG_TMS) ; port JTAG.TMS
PCIE_CLK_N: U401.A21(PCIE_CLK_N) ; port PCIE.CLK_N  [project net PCIE.CLK_N]
PCIE_CLK_P: U401.B21(PCIE_CLK_P) ; port PCIE.CLK_P  [project net PCIE.CLK_P]
PCIE_RX_N: U401.A19(PCIE_RXN_N) ; port PCIE.RX_N  [project net PCIE.RX_N]
PCIE_RX_P: U401.B19(PCIE_RXN_P) ; port PCIE.RX_P  [project net PCIE.RX_P]
PCIE_TX_N: U401.A20(PCIE_TXN_N) ; port PCIE.TX_N  [project net PCIE.TX_N]
PCIE_TX_P: U401.B20(PCIE_TXN_P) ; port PCIE.TX_P  [project net PCIE.TX_P]
PMIC_IRQ_B: U401.AF13(GPIO1_IO03) ; port PMIC_CTRL.IRQ_B  [project net PMIC_CTRL.IRQ_B]
SD1_CLK: U401.V26(SD1_CLK) ; port EMMC.CLK  [project net EMMC.CLK]
SD1_CMD: U401.V27(SD1_CMD) ; port EMMC.CMD  [project net EMMC.CMD]
SD1_DAT0: U401.Y27(SD1_DATA0) ; port EMMC.DAT0  [project net EMMC.DAT0]
SD1_DAT1: U401.Y26(SD1_DATA1) ; port EMMC.DAT1  [project net EMMC.DAT1]
SD1_DAT2: U401.T27(SD1_DATA2) ; port EMMC.DAT2  [project net EMMC.DAT2]
SD1_DAT3: U401.T26(SD1_DATA3) ; port EMMC.DAT3  [project net EMMC.DAT3]
SD1_DAT4: U401.U27(SD1_DATA4) ; port EMMC.DAT4  [project net EMMC.DAT4]
SD1_DAT5: U401.U26(SD1_DATA5) ; port EMMC.DAT5  [project net EMMC.DAT5]
SD1_DAT6: U401.W27(SD1_DATA6) ; port EMMC.DAT6  [project net EMMC.DAT6]
SD1_DAT7: U401.W26(SD1_DATA7) ; port EMMC.DAT7  [project net EMMC.DAT7]
SD1_DS: U401.R24(SD1_STROBE) ; port EMMC.DS  [project net EMMC.DS]
SD2_CLK: U401.W23(SD2_CLK) ; port SD.CLK  [project net SD.CLK]
SD2_CMD: U401.W24(SD2_CMD) ; port SD.CMD  [project net SD.CMD]
SD2_DAT0: U401.AB23(SD2_DATA0) ; port SD.DAT0  [project net SD.DAT0]
SD2_DAT1: U401.AB24(SD2_DATA1) ; port SD.DAT1  [project net SD.DAT1]
SD2_DAT2: U401.V24(SD2_DATA2) ; port SD.DAT2  [project net SD.DAT2]
SD2_DAT3: U401.V23(SD2_DATA3) ; port SD.DAT3  [project net SD.DAT3]
SD2_VSEL: U401.AG12(GPIO1_IO04) ; port PMIC_CTRL.SD2_VSEL  [project net PMIC_CTRL.SD2_VSEL]
UART2_RXD: U401.F15(UART2_RXD) ; port UART2_RXD
UART2_TXD: U401.E15(UART2_TXD) ; port UART2_TXD
UART4_RXD: U401.F19(UART4_RXD) ; port UART4_RXD
UART4_TXD: U401.F18(UART4_TXD) ; port UART4_TXD
WDOG_B: U401.AG13(GPIO1_IO02) ; port PMIC_CTRL.WDOG_B  [project net PMIC_CTRL.WDOG_B]
NetR409_1: R409.1 U401.D19(PCIE_RESREF)

Not connected (* = marked no-connect by the designer): U401 A11(MIPI_DSI_CLK_N)* AA27(SD2_WP)* AB9(GPIO1_IO15)* AB10(GPIO1_IO12)* AB15(SAI5_RXFS)* AB18(SAI1_MCLK)* AB19(SAI1_TXFS)* AB22(SAI2_RXC)* AC6(SAI3_TXFS)* AC9(GPIO1_IO14)* AC10(GPIO1_IO11)* AC13(SAI5_RXD3)* AC14(SAI5_RXD1)* AC15(SAI5_RXC)* AC18(SAI1_TXC)* AC19(SAI2_RXFS)* AC22(SAI2_TXD0)* AC24(SAI2_RXD0)* AD6(SAI3_MCLK)* AD9(GPIO1_IO13)* AD10(GPIO1_IO10)* AD13(SAI5_RXD2)* AD15(SAI5_MCLK)* AD18(SAI5_RXD0)* AD19(SAI2_MCLK)* AD23(SAI2_TXFS)* AF6(SAI3_TXD)* AF7(SAI3_RXD)* AF8(SPDIF_EXT_CLK)* AF9(SPDIF_TX)* AF10(GPIO1_IO09)* AF11(GPIO1_IO07)* AF12(GPIO1_IO05)* AF14(GPIO1_IO01)* AF16(SAI1_RXC)* AG6(SAI3_TXC)* AG7(SAI3_RXC)* AG8(SAI3_RXFS)* AG9(SPDIF_RX)* AG10(GPIO1_IO08)* AG11(GPIO1_IO06)* AG14(GPIO1_IO00)* AG16(SAI1_RXFS)* B11(MIPI_DSI_CLK_P)* D9(I2C2_SDA)* D10(I2C2_SCL)* D15(MIPI_VREG_CAP)* D18(UART3_TXD)* E10(I2C3_SCL)* E14(UART1_RXD)* E18(UART3_RXD)* F10(I2C3_SDA)* F13(UART1_TXD)*

### Buses and harness runs
bus ENET_RD[0..3]
bus ENET_TD[0..3]

### Notes on the sheet
- default debug console
- (in symbol TITLE_BLOCK) Project; File; Variant; Page; /; Date; Revision; Author; Reviewer

### Library data of the parts
R409 = CMP-03412-049761-1: Anti-Sulfurated Chip Resistors Automotive Grade 8.2kΩ 1% 200ppm/°C 0201; Max Power Dissipation: 50mW; Width: 0.012inch; Min Operating Temperature: -55°C; Number of Terminations: 2; Packaging: Tape and Reel; Resistor Type: Thick Film; Height: 0.01inch; RoHS Compliant: Yes; Series: AF; Length: 0.024inch; Max Operating Temperature: 125°C; Temperature Coefficient: 200ppm/°C; Features: Moisture Resistant
U401 = CMP-10096-000012-1: IC MPU I.MX 8M MINI QUAD BGA; RoHS Compliant: Yes
TB?#11 = TITLE_BLOCK: Review Date: *

## Sheet 12 uart.SchDoc
size A3; SheetNumber: 16; SheetTotal: 16
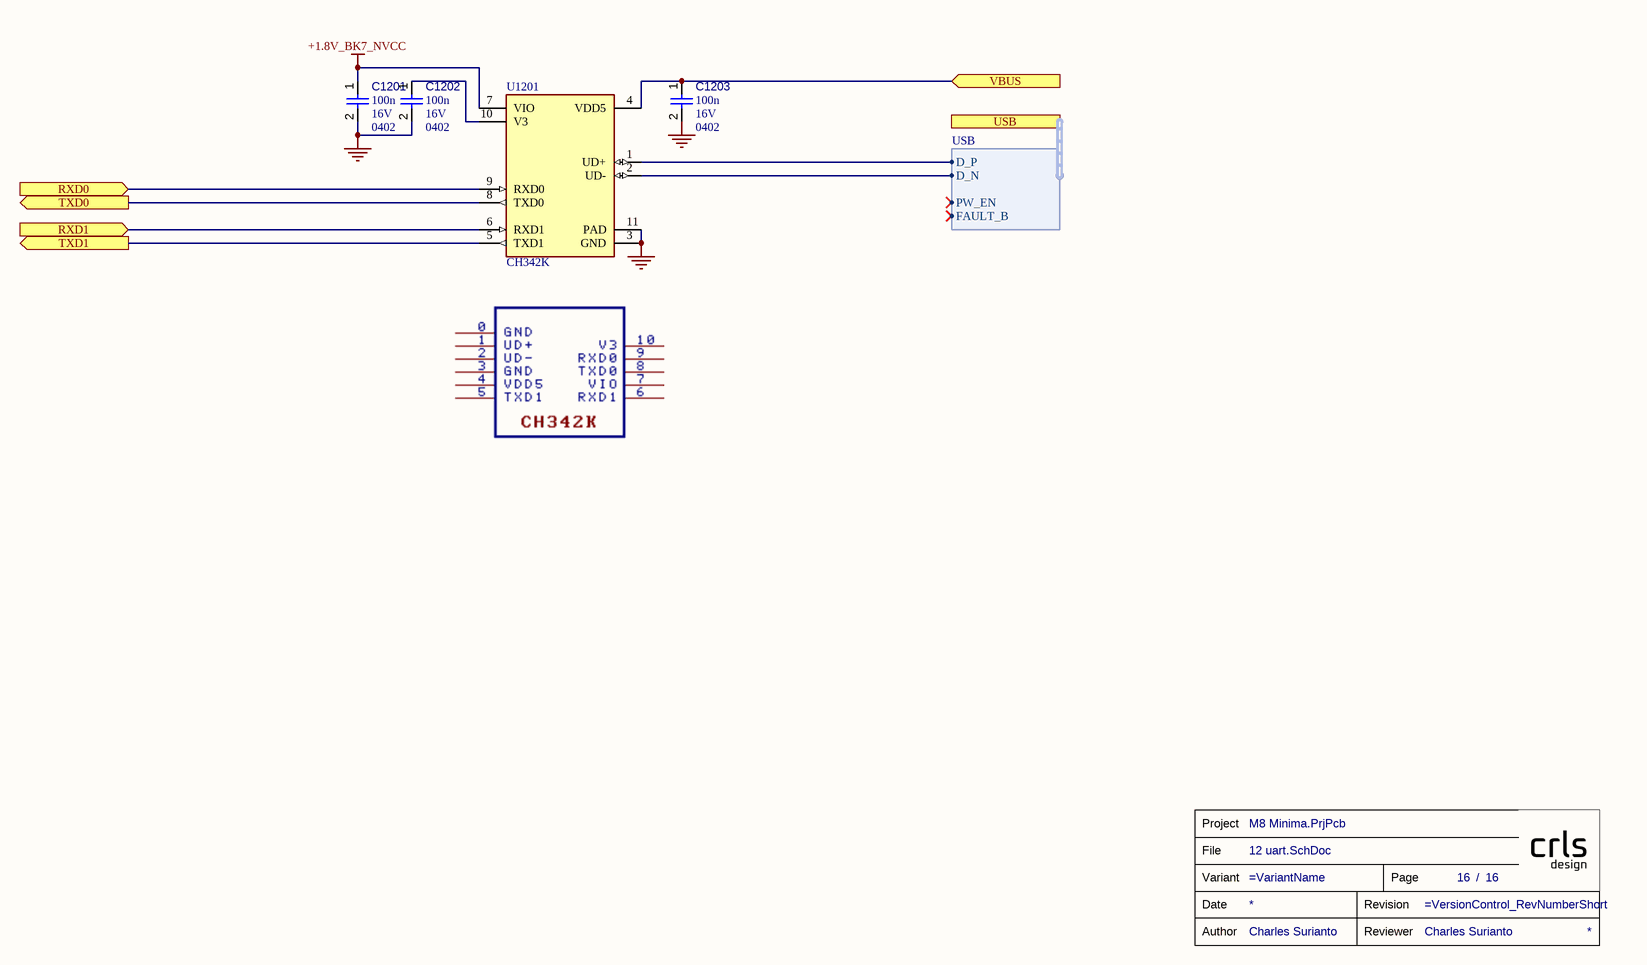
[diagram p14: 12 uart.SchDoc]

### Parts
(Parts that share a designator on the sheet are numbered #1, #2 ... from top to bottom, then left to right.)
C1201  value 100n  Case/Package: 0402  Voltage Rating: 16V  [CAPC0402(1005)60_L]  (hidden comment: Capacitors,0402,100n,16V)
C1202  value 100n  Case/Package: 0402  Voltage Rating: 16V  [CAPC0402(1005)60_L]  (hidden comment: Capacitors,0402,100n,16V)
C1203  value 100n  Case/Package: 0402  Voltage Rating: 16V  [CAPC0402(1005)60_L]  (hidden comment: Capacitors,0402,100n,16V)
TB?#12  Reviewer: Charles Surianto  (hidden comment: TITLE_BLOCK)  (graphical)
U1201  CH342K  [ESSOP-10_L4.9-W3.9-P1.0-LS6.0-TL-EP]

### Ports
RXD0 (in), RXD1 (in), TXD0 (out), TXD1 (out), USB (harness USB), VBUS (in)

### Harnesses
USB: D_P, D_N, PW_EN, FAULT_B

### Nets
+1.8V_BK7_NVCC: C1201.1 U1201.7(VIO)
GND: C1201.2 C1202.2 C1203.2 U1201.3(GND) U1201.11(PAD)
UART2_RXD: U1201.5(TXD1) ; port TXD1
UART2_TXD: U1201.6(RXD1) ; port RXD1
UART4_RXD: U1201.8(TXD0) ; port TXD0
UART4_TXD: U1201.9(RXD0) ; port RXD0
UART_USB.D_N: U1201.2(UD-) ; port USB.D_N
UART_USB.D_P: U1201.1(UD+) ; port USB.D_P
UART_VBUS: C1203.1 U1201.4(VDD5) ; port VBUS
NetC1202_1: C1202.1 U1201.10(V3)

### Notes on the sheet
- (in symbol TITLE_BLOCK) Project; File; Variant; Page; /; Date; Revision; Author; Reviewer

### Library data of the parts
C1201-C1203 = Capacitors: Capacitor; Component Type: Capacitors
U1201 = CH342K: ESSOP-10-150mil USB Converters ROHS
TB?#12 = TITLE_BLOCK: Review Date: *

## Sheet A1 power map.SchDoc
size A3; SheetNumber: 2; SheetTotal: 16
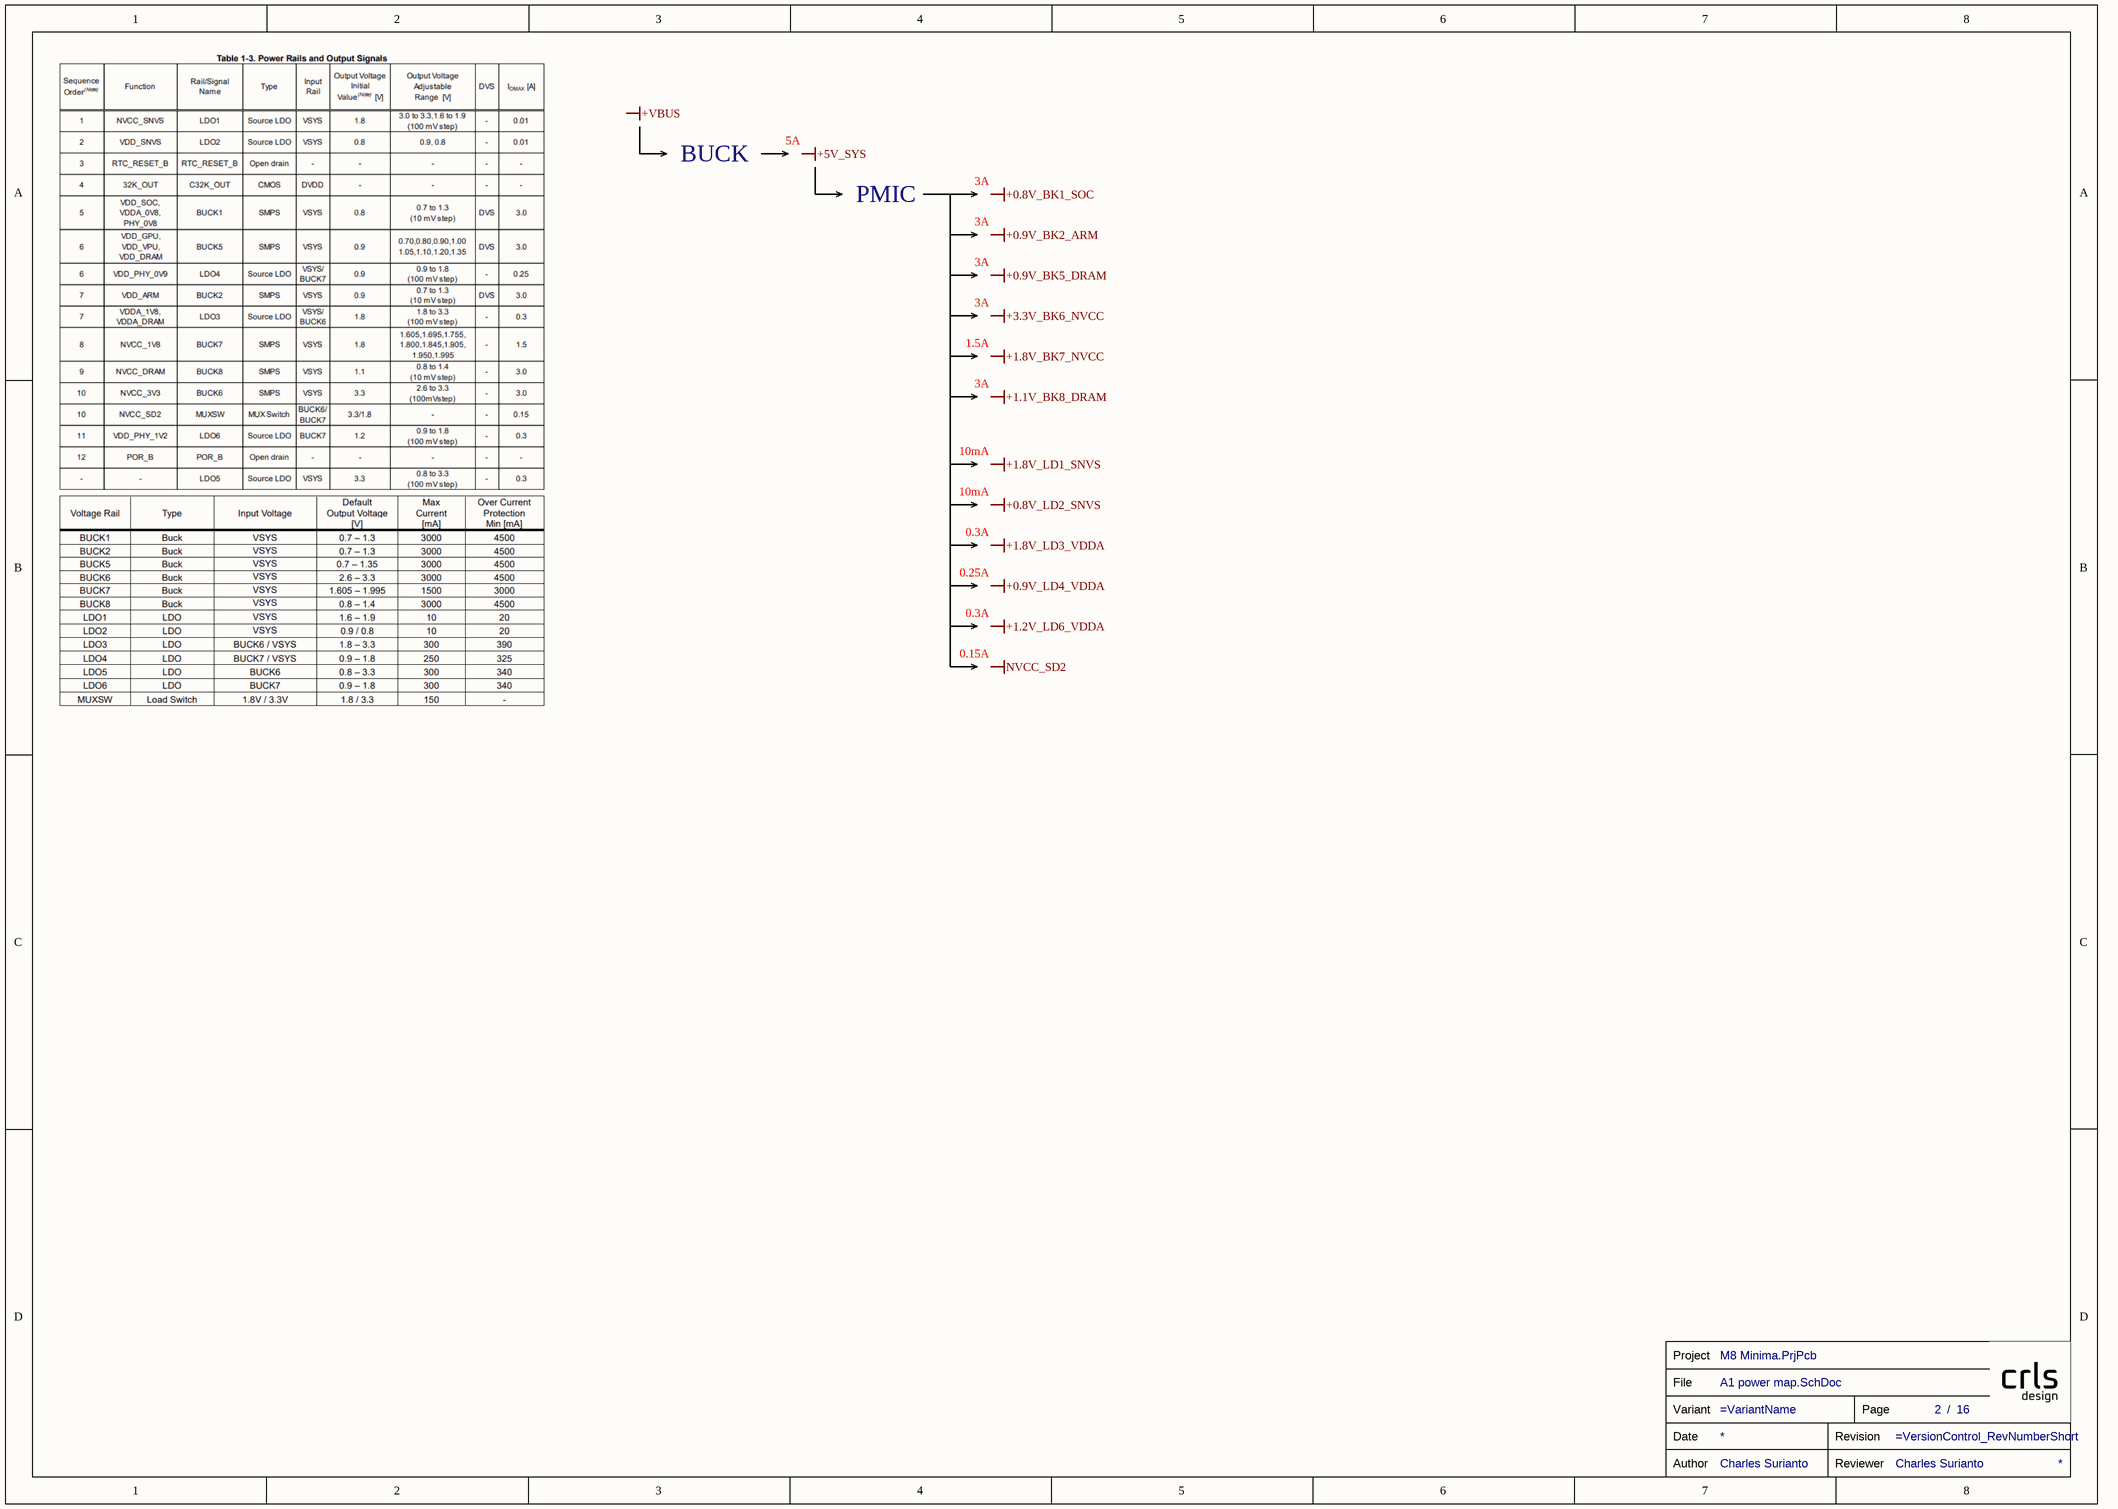
[diagram p15: A1 power map.SchDoc]

### Parts
(Parts that share a designator on the sheet are numbered #1, #2 ... from top to bottom, then left to right.)
TB?#13  Reviewer: Charles Surianto  (hidden comment: TITLE_BLOCK)  (graphical)

### Notes on the sheet
- BUCK
- 5A
- 3A
- PMIC
- 1.5A
- 10mA
- 0.3A
- 0.25A
- 0.15A
- Labels drawn without touching a wire or pin: +0.8V_BK1_SOC, +0.8V_LD2_SNVS, +0.9V_BK2_ARM, +0.9V_BK5_DRAM, +0.9V_LD4_VDDA, +1.1V_BK8_DRAM, +1.2V_LD6_VDDA, +1.8V_BK7_NVCC, +1.8V_LD1_SNVS, +1.8V_LD3_VDDA, +3.3V_BK6_NVCC, +5V_SYS, +VBUS, NVCC_SD2
- (in symbol TITLE_BLOCK) Project; File; Variant; Page; /; Date; Revision; Author; Reviewer

### Library data of the parts
TB?#13 = TITLE_BLOCK: Review Date: *

## Nets that join several sheets
+0.8V_BK1_SOC: 03 pmic (C313.1 C314.1 L301.2 U301.17), 04-1 m8 power (27 pins)
+0.8V_LD2_SNVS: 03 pmic (C330.1 U301.8), 04-1 m8 power (C418.1 U401.K22), 04-2 m8 io 1 (U401.B25)
+0.9V_BK2_ARM: 03 pmic (C318.1 C319.1 L302.2 U301.24), 04-1 m8 power (20 pins)
+0.9V_BK5_DRAM: 03 pmic (C320.1 C321.1 L303.2 U301.30), 04-1 m8 power (27 pins)
+1.1V_BK8_DRAM: 03 pmic (C327.1 C328.1 L306.2 U301.38), 04-1 m8 power (20 pins), 04-2 m8 io 1 (U401.M9), 05 lpddr4 ram (64 pins)
+1.8V_BK7_NVCC: 03 pmic (9 pins), 04-1 m8 power (22 pins), 04-4 m8 boot config (11 pins), 05 lpddr4 ram (14 pins), 06 ethernet (8 pins), 07 flash (9 pins), 12 uart (C1201.1 U1201.7)
+1.8V_LD1_SNVS: 03 pmic (8 pins), 04-1 m8 power (C451.1 U401.J22), 04-2 m8 io 1 (R404.1)
+1.8V_LD3_VDDA: 03 pmic (C331.1 U301.6), 04-1 m8 power (16 pins)
+3.3V_BK6_NVCC: 03 pmic (9 pins), 04-1 m8 power (6 pins), 06 ethernet (12 pins), 07 flash (11 pins), 08 usb hub (14 pins), 11 pcie (13 pins)
+5V_SYS: 02 power input (5 pins), 03 pmic (20 pins), 04-1 m8 power (R402.2), 11 pcie (R1101.1), USBH1 (C1001_USBH1.1 R1001_USBH1.1 U1001_USBH1.1), USBH2 (C1001_USBH2.1 R1001_USBH2.1 U1001_USBH2.1), USBH3 (C1001_USBH3.1 R1001_USBH3.1 U1001_USBH3.1)
GND: 02 power input (24 pins), 03 pmic (42 pins), 04-1 m8 power (156 pins), 04-2 m8 io 1 (9 pins), 04-4 m8 boot config (R418.2 R422.2 R423.2), 05 lpddr4 ram (81 pins), 06 ethernet (29 pins), 07 flash (24 pins), 08 usb hub (21 pins), 11 pcie (17 pins), USB_UART (8 pins), USBH1 (10 pins), USBH2 (10 pins), USBH3 (10 pins), USB1 (8 pins), 04-3 m8 io 2 (11 pins), 12 uart (5 pins)
NVCC_SD2: 03 pmic (C334.1 C335.1 U301.55), 04-1 m8 power (C450.1 U401.V22), 07 flash (5 pins)
A_CA0: 04-2 m8 io 1 (U401.W6), 05 lpddr4 ram (U501.H2)
A_CA1: 04-2 m8 io 1 (U401.V6), 05 lpddr4 ram (U501.J2)
A_CA2: 04-2 m8 io 1 (U401.AC4), 05 lpddr4 ram (U501.H9)
A_CA3: 04-2 m8 io 1 (U401.AD5), 05 lpddr4 ram (U501.H10)
A_CA4: 04-2 m8 io 1 (U401.R4), 05 lpddr4 ram (U501.H11)
A_CA5: 04-2 m8 io 1 (U401.R5), 05 lpddr4 ram (U501.J11)
A_DMI0: 04-2 m8 io 1 (U401.AB1), 05 lpddr4 ram (U501.C3)
A_DMI1: 04-2 m8 io 1 (U401.AG4), 05 lpddr4 ram (U501.C10)
A_DQ0: 04-2 m8 io 1 (U401.B5), 05 lpddr4 ram (U501.AA11)
A_DQ0: 04-2 m8 io 1 (U401.AC1), 05 lpddr4 ram (U501.B2)
A_DQ1: 04-2 m8 io 1 (U401.A5), 05 lpddr4 ram (U501.Y11)
A_DQ1: 04-2 m8 io 1 (U401.AA2), 05 lpddr4 ram (U501.C2)
A_DQ2: 04-2 m8 io 1 (U401.B1), 05 lpddr4 ram (U501.V11)
A_DQ2: 04-2 m8 io 1 (U401.W1), 05 lpddr4 ram (U501.E2)
A_DQ3: 04-2 m8 io 1 (U401.D1), 05 lpddr4 ram (U501.U11)
A_DQ3: 04-2 m8 io 1 (U401.W2), 05 lpddr4 ram (U501.F2)
A_DQ4: 04-2 m8 io 1 (U401.D2), 05 lpddr4 ram (U501.U9)
A_DQ4: 04-2 m8 io 1 (U401.V2), 05 lpddr4 ram (U501.F4)
A_DQ5: 04-2 m8 io 1 (U401.C1), 05 lpddr4 ram (U501.V9)
A_DQ5: 04-2 m8 io 1 (U401.V1), 05 lpddr4 ram (U501.E4)
A_DQ6: 04-2 m8 io 1 (U401.A3), 05 lpddr4 ram (U501.Y9)
A_DQ6: 04-2 m8 io 1 (U401.AB2), 05 lpddr4 ram (U501.C4)
A_DQ7: 04-2 m8 io 1 (U401.B4), 05 lpddr4 ram (U501.AA9)
A_DQ7: 04-2 m8 io 1 (U401.AC2), 05 lpddr4 ram (U501.B4)
A_DQ8: 04-2 m8 io 1 (U401.E1), 05 lpddr4 ram (U501.AA2)
A_DQ8: 04-2 m8 io 1 (U401.AF5), 05 lpddr4 ram (U501.B11)
A_DQ9: 04-2 m8 io 1 (U401.G2), 05 lpddr4 ram (U501.Y2)
A_DQ9: 04-2 m8 io 1 (U401.AG5), 05 lpddr4 ram (U501.C11)
A_DQ10: 04-2 m8 io 1 (U401.J1), 05 lpddr4 ram (U501.V2)
A_DQ10: 04-2 m8 io 1 (U401.AF1), 05 lpddr4 ram (U501.E11)
A_DQ11: 04-2 m8 io 1 (U401.J2), 05 lpddr4 ram (U501.U2)
A_DQ11: 04-2 m8 io 1 (U401.AD1), 05 lpddr4 ram (U501.F11)
A_DQ12: 04-2 m8 io 1 (U401.K2), 05 lpddr4 ram (U501.U4)
A_DQ12: 04-2 m8 io 1 (U401.AD2), 05 lpddr4 ram (U501.F9)
A_DQ13: 04-2 m8 io 1 (U401.K1), 05 lpddr4 ram (U501.V4)
A_DQ13: 04-2 m8 io 1 (U401.AE1), 05 lpddr4 ram (U501.E9)
A_DQ14: 04-2 m8 io 1 (U401.F2), 05 lpddr4 ram (U501.Y4)
A_DQ14: 04-2 m8 io 1 (U401.AG3), 05 lpddr4 ram (U501.C9)
A_DQ15: 04-2 m8 io 1 (U401.E2), 05 lpddr4 ram (U501.AA4)
A_DQ15: 04-2 m8 io 1 (U401.AF4), 05 lpddr4 ram (U501.B9)
A_DQS0_N: 04-2 m8 io 1 (U401.Y1), 05 lpddr4 ram (U501.E3)
A_DQS0_P: 04-2 m8 io 1 (U401.AA1), 05 lpddr4 ram (U501.D3)
A_DQS1_N: 04-2 m8 io 1 (U401.AF2), 05 lpddr4 ram (U501.E10)
A_DQS1_P: 04-2 m8 io 1 (U401.AG2), 05 lpddr4 ram (U501.D10)
B_CA0: 04-2 m8 io 1 (U401.J6), 05 lpddr4 ram (U501.R2)
B_CA1: 04-2 m8 io 1 (U401.K6), 05 lpddr4 ram (U501.P2)
B_CA2: 04-2 m8 io 1 (U401.E4), 05 lpddr4 ram (U501.R9)
B_CA3: 04-2 m8 io 1 (U401.D5), 05 lpddr4 ram (U501.R10)
B_CA4: 04-2 m8 io 1 (U401.N4), 05 lpddr4 ram (U501.R11)
B_CA5: 04-2 m8 io 1 (U401.N5), 05 lpddr4 ram (U501.P11)
B_DMI0: 04-2 m8 io 1 (U401.F1), 05 lpddr4 ram (U501.Y3)
B_DMI1: 04-2 m8 io 1 (U401.A4), 05 lpddr4 ram (U501.Y10)
B_DQS0_N: 04-2 m8 io 1 (U401.H1), 05 lpddr4 ram (U501.V3)
B_DQS0_P: 04-2 m8 io 1 (U401.G1), 05 lpddr4 ram (U501.W3)
B_DQS1_N: 04-2 m8 io 1 (U401.B2), 05 lpddr4 ram (U501.V10)
B_DQS1_P: 04-2 m8 io 1 (U401.A2), 05 lpddr4 ram (U501.W10)
CLKREQ_B: 11 pcie (J1101.53 R1103.2), 04-3 m8 io 2 (U401.D13)
DRAM_CHA.CK_N: 04-2 m8 io 1 (U401.L1), 05 lpddr4 ram (U501.P9)
DRAM_CHA.CK_P: 04-2 m8 io 1 (U401.L2), 05 lpddr4 ram (U501.P8)
DRAM_CHA.CKE0: 04-2 m8 io 1 (U401.F4), 05 lpddr4 ram (U501.P4)
DRAM_CHA.CKE1: 04-2 m8 io 1 (U401.F5), 05 lpddr4 ram (U501.P5)
DRAM_CHA.CS0: 04-2 m8 io 1 (U401.K4), 05 lpddr4 ram (U501.R4)
DRAM_CHA.CS1: 04-2 m8 io 1 (U401.J4), 05 lpddr4 ram (U501.R3)
DRAM_CHB.CK_N: 04-2 m8 io 1 (U401.U1), 05 lpddr4 ram (U501.J9)
DRAM_CHB.CK_P: 04-2 m8 io 1 (U401.U2), 05 lpddr4 ram (U501.J8)
DRAM_CHB.CKE0: 04-2 m8 io 1 (U401.AB4), 05 lpddr4 ram (U501.J4)
DRAM_CHB.CKE1: 04-2 m8 io 1 (U401.AB5), 05 lpddr4 ram (U501.J5)
DRAM_CHB.CS0: 04-2 m8 io 1 (U401.V4), 05 lpddr4 ram (U501.H4)
DRAM_CHB.CS1: 04-2 m8 io 1 (U401.W4), 05 lpddr4 ram (U501.H3)
DRAM_RST_B: 04-2 m8 io 1 (U401.R1), 05 lpddr4 ram (R501.1 U501.T11)
EMMC.CLK: 07 flash (U701.M6), 04-3 m8 io 2 (U401.V26)
EMMC.CMD: 07 flash (U701.M5), 04-3 m8 io 2 (U401.V27)
EMMC.DAT0: 07 flash (U701.A3), 04-3 m8 io 2 (U401.Y27)
EMMC.DAT1: 07 flash (U701.A4), 04-3 m8 io 2 (U401.Y26)
EMMC.DAT2: 07 flash (U701.A5), 04-3 m8 io 2 (U401.T27)
EMMC.DAT3: 07 flash (U701.B2), 04-3 m8 io 2 (U401.T26)
EMMC.DAT4: 07 flash (U701.B3), 04-3 m8 io 2 (U401.U27)
EMMC.DAT5: 07 flash (U701.B4), 04-3 m8 io 2 (U401.U26)
EMMC.DAT6: 07 flash (U701.B5), 04-3 m8 io 2 (U401.W27)
EMMC.DAT7: 07 flash (U701.B6), 04-3 m8 io 2 (U401.W26)
EMMC.DS: 07 flash (U701.H5), 04-3 m8 io 2 (U401.R24)
ENET_INT_B: 06 ethernet (R602.2 U601.31), 04-3 m8 io 2 (U401.AD22)
ENET_RD0: 06 ethernet (R604.2 R608.1), 04-3 m8 io 2 (U401.AE27)
ENET_RD1: 06 ethernet (R605.2 R610.1), 04-3 m8 io 2 (U401.AD27)
ENET_RD2: 06 ethernet (R612.1 R619.1), 04-3 m8 io 2 (U401.AD26)
ENET_RD3: 06 ethernet (R606.2 R614.1), 04-3 m8 io 2 (U401.AC26)
ENET_RST_B: 06 ethernet (R601.2 U601.12), 04-3 m8 io 2 (U401.E13)
ENET_TD0: 06 ethernet (R607.1), 04-3 m8 io 2 (U401.AG26)
ENET_TD1: 06 ethernet (R609.1), 04-3 m8 io 2 (U401.AF26)
ENET_TD2: 06 ethernet (R611.1), 04-3 m8 io 2 (U401.AG25)
ENET_TD3: 06 ethernet (R613.1), 04-3 m8 io 2 (U401.AF25)
HUB_RST_B: 04-2 m8 io 1 (U401.B8), 08 usb hub (R801.2 U801.26)
HUB_USB1.D_N: 08 usb hub (U801.1), USBH1 (J1001_USBH1.A7 J1001_USBH1.B7)
HUB_USB1.D_P: 08 usb hub (U801.2), USBH1 (J1001_USBH1.A6 J1001_USBH1.B6)
HUB_USB1.FAULT_B: 08 usb hub (U801.13), USBH1 (R1001_USBH1.2 U1001_USBH1.4)
HUB_USB1.PW_EN: 08 usb hub (U801.12), USBH1 (U1001_USBH1.3)
HUB_USB2.D_N: 08 usb hub (U801.3), USBH2 (J1001_USBH2.A7 J1001_USBH2.B7)
HUB_USB2.D_P: 08 usb hub (U801.4), USBH2 (J1001_USBH2.A6 J1001_USBH2.B6)
HUB_USB2.FAULT_B: 08 usb hub (U801.17), USBH2 (R1001_USBH2.2 U1001_USBH2.4)
HUB_USB2.PW_EN: 08 usb hub (U801.16), USBH2 (U1001_USBH2.3)
HUB_USB3.D_N: 08 usb hub (U801.6), USBH3 (J1001_USBH3.A7 J1001_USBH3.B7)
HUB_USB3.D_P: 08 usb hub (U801.7), USBH3 (J1001_USBH3.A6 J1001_USBH3.B6)
HUB_USB3.FAULT_B: 08 usb hub (U801.19), USBH3 (R1001_USBH3.2 U1001_USBH3.4)
HUB_USB3.PW_EN: 08 usb hub (U801.18), USBH3 (U1001_USBH3.3)
HUB_USB4.D_N: 08 usb hub (U801.8), 11 pcie (J1101.5)
HUB_USB4.D_P: 08 usb hub (U801.9), 11 pcie (J1101.3)
HUB_USB4.FAULT_B: 08 usb hub (U801.21), 11 pcie (R1101.2)
JTAG_MOD: 04-4 m8 boot config (R422.1), 04-3 m8 io 2 (U401.D27)
JTAG_TCK: 04-4 m8 boot config (R423.1), 04-3 m8 io 2 (U401.F26)
JTAG_TDI: 04-4 m8 boot config (R420.2), 04-3 m8 io 2 (U401.E27)
JTAG_TMS: 04-4 m8 boot config (R419.2), 04-3 m8 io 2 (U401.F27)
JTAG_TRST_B: 04-2 m8 io 1 (U401.C27), 04-4 m8 boot config (R421.2)
PCI_RST_B: 04-2 m8 io 1 (U401.A6), 11 pcie (J1101.52 R1102.2)
PCI_WAKE_B: 04-2 m8 io 1 (U401.A8), 11 pcie (J1101.55 R1105.2)
PCIE.CLK_N: 11 pcie (J1101.49), 04-3 m8 io 2 (U401.A21)
PCIE.CLK_P: 11 pcie (J1101.47), 04-3 m8 io 2 (U401.B21)
PCIE.RX_N: 11 pcie (J1101.43), 04-3 m8 io 2 (U401.A19)
PCIE.RX_P: 11 pcie (J1101.41), 04-3 m8 io 2 (U401.B19)
PCIE.TX_N: 11 pcie (C1106.1), 04-3 m8 io 2 (U401.A20)
PCIE.TX_P: 11 pcie (C1105.1), 04-3 m8 io 2 (U401.B20)
PMIC_CLK32K: 03 pmic (R307.1), 04-2 m8 io 1 (U401.A26)
PMIC_CTRL.IRQ_B: 03 pmic (R304.2 U301.39), 04-3 m8 io 2 (U401.AF13)
PMIC_CTRL.ON_REQ: 03 pmic (U301.15), 04-2 m8 io 1 (U401.A24)
PMIC_CTRL.POR_B: 03 pmic (R303.2 U301.25), 04-2 m8 io 1 (U401.B24)
PMIC_CTRL.RTC_RST_B: 03 pmic (R305.2 U301.3), 04-2 m8 io 1 (U401.F24)
PMIC_CTRL.SCL: 03 pmic (R301.2 U301.26), 04-3 m8 io 2 (U401.E9)
PMIC_CTRL.SD2_VSEL: 03 pmic (U301.45), 04-3 m8 io 2 (U401.AG12)
PMIC_CTRL.SDA: 03 pmic (R302.2 U301.27), 04-3 m8 io 2 (U401.F9)
PMIC_CTRL.STB_REQ: 03 pmic (U301.16), 04-2 m8 io 1 (U401.E24)
PMIC_CTRL.WDOG_B: 03 pmic (R306.2 U301.2), 04-3 m8 io 2 (U401.AG13)
RGMII.MDC: 06 ethernet (U601.13), 04-3 m8 io 2 (U401.AC27)
RGMII.MDIO: 06 ethernet (R603.2 U601.14), 04-3 m8 io 2 (U401.AB27)
RGMII.RXC: 06 ethernet (R616.1 R620.1), 04-3 m8 io 2 (U401.AE26)
RGMII.RXCTL: 06 ethernet (R618.1 R621.1), 04-3 m8 io 2 (U401.AF27)
RGMII.TXC: 06 ethernet (R615.1), 04-3 m8 io 2 (U401.AG24)
RGMII.TXCTL: 06 ethernet (R617.1), 04-3 m8 io 2 (U401.AF24)
SD1_RST_B: 04-2 m8 io 1 (U401.R23), 07 flash (U701.K5)
SD.CLK: 07 flash (J701.5), 04-3 m8 io 2 (U401.W23)
SD.CMD: 07 flash (J701.3 R703.2), 04-3 m8 io 2 (U401.W24)
SD.DAT0: 07 flash (J701.7 R704.2), 04-3 m8 io 2 (U401.AB23)
SD.DAT1: 07 flash (J701.8 R705.2), 04-3 m8 io 2 (U401.AB24)
SD.DAT2: 07 flash (J701.1 R701.2), 04-3 m8 io 2 (U401.V24)
SD.DAT3: 07 flash (J701.2 R702.2), 04-3 m8 io 2 (U401.V23)
TEST_MD: 04-2 m8 io 1 (U401.D26), 04-4 m8 boot config (R417.2 R418.1)
UART2_RXD: 04-3 m8 io 2 (U401.F15), 12 uart (U1201.5)
UART2_TXD: 04-3 m8 io 2 (U401.E15), 12 uart (U1201.6)
UART4_RXD: 04-3 m8 io 2 (U401.F19), 12 uart (U1201.8)
UART4_TXD: 04-3 m8 io 2 (U401.F18), 12 uart (U1201.9)
UART_USB.D_N: USB_UART (J901_USB_UART.A7 J901_USB_UART.B7), 12 uart (U1201.2)
UART_USB.D_P: USB_UART (J901_USB_UART.A6 J901_USB_UART.B6), 12 uart (U1201.1)
UART_VBUS: USB_UART (J901_USB_UART.A4-B9 J901_USB_UART.B4-A9), 12 uart (C1203.1 U1201.4)
USB1.D_N: 04-2 m8 io 1 (U401.A22), USB1 (J901_USB1.A7 J901_USB1.B7)
USB1.D_P: 04-2 m8 io 1 (U401.B22), USB1 (J901_USB1.A6 J901_USB1.B6)
USB2.D_N: 04-2 m8 io 1 (U401.A23), 08 usb hub (U801.30)
USB2.D_P: 04-2 m8 io 1 (U401.B23), 08 usb hub (U801.31)
VBUS1: 04-1 m8 power (R401.2), USB1 (J901_USB1.A4-B9 J901_USB1.B4-A9)
W_DIS1_B: 04-2 m8 io 1 (U401.A7), 11 pcie (J1101.56 R1106.2)
W_DIS2_B: 04-2 m8 io 1 (U401.B6), 11 pcie (J1101.54 R1104.2)